# EAGLE design qad-center-v0.7 (EAGLE 6.4.4)

## Sheet 1 of 3
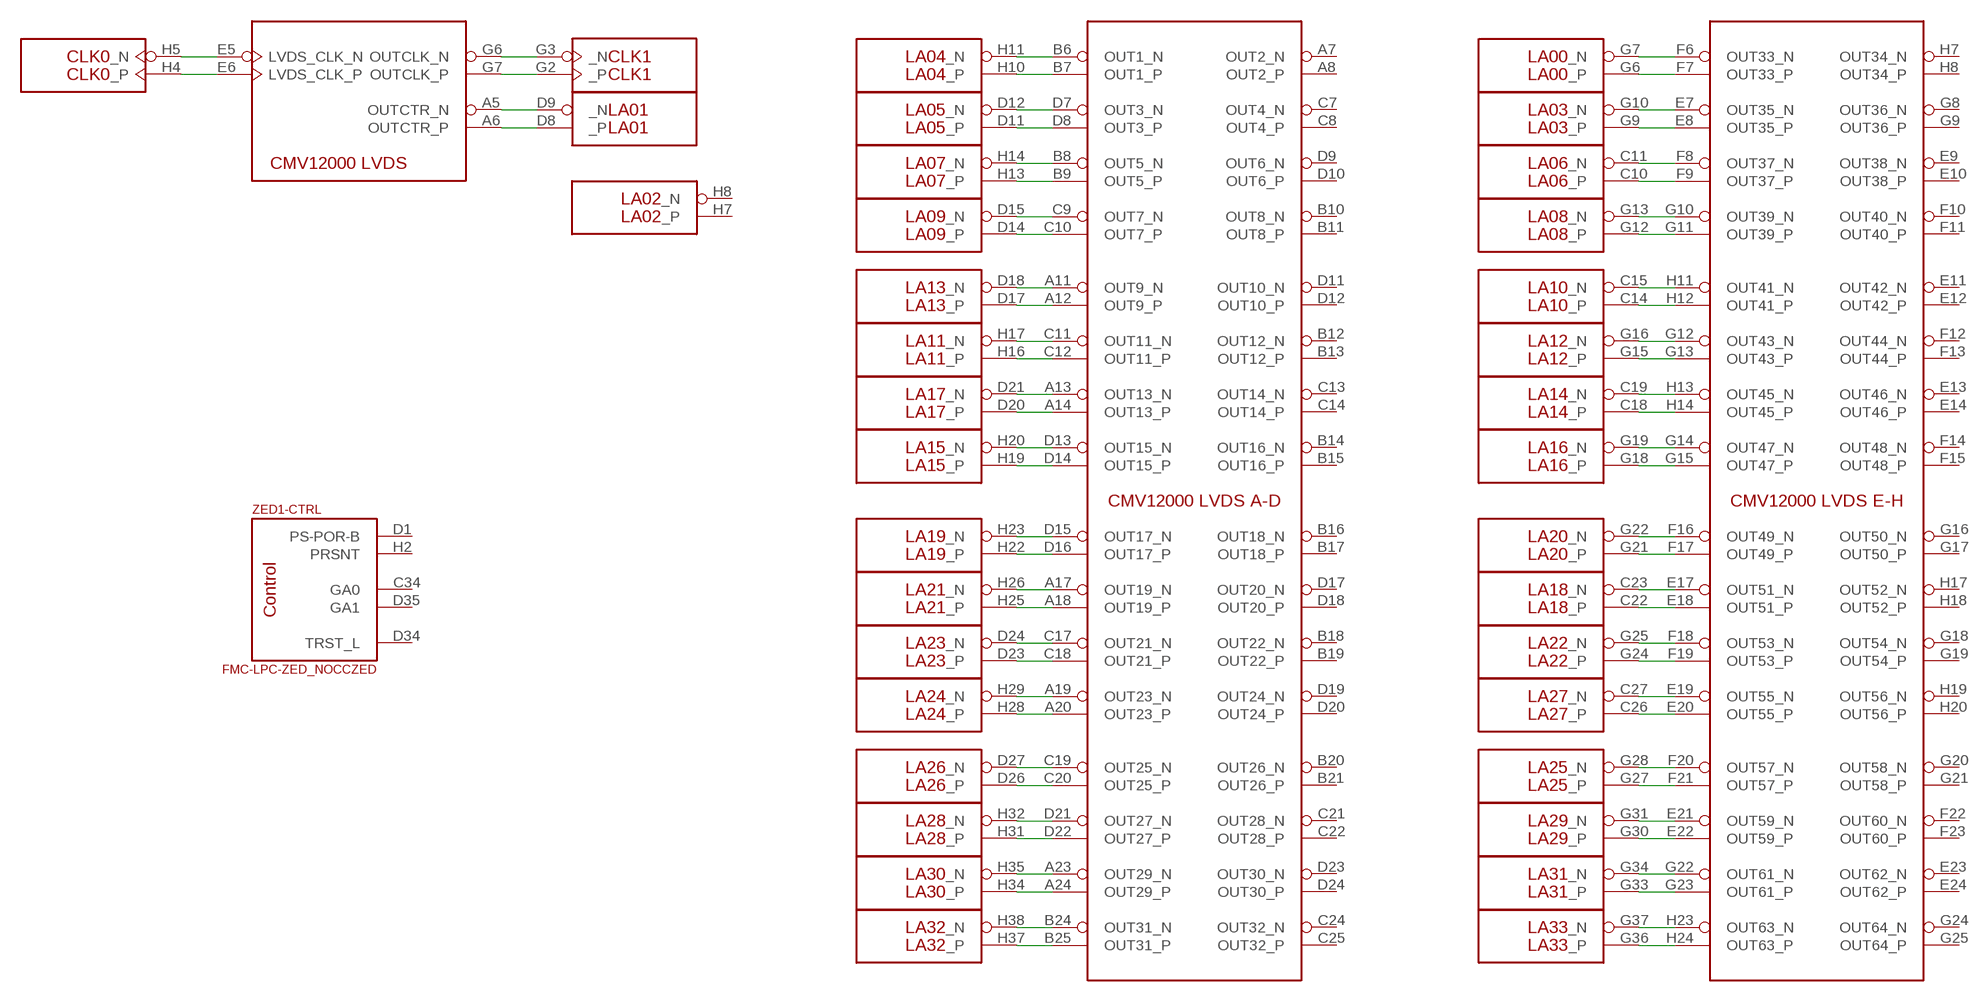
[diagram p0: schematic, sheet 1]

### Parts
U$1  CMV12000ANDON+LM  [10-30-07-237-400T4+LM]
ZED1  FMC-LPC-ZED_NOCCZED  [ASP-134604-01-ZED]

### Nets
N$24: U$1.B6(OUT1_N) ZED1.H11(LA04:_N)
N$25: U$1.B7(OUT1_P) ZED1.H10(LA04:_P)
N$27: U$1.D7(OUT3_N) ZED1.D12(LA05:_N)
N$28: U$1.D8(OUT3_P) ZED1.D11(LA05:_P)
N$34: U$1.B8(OUT5_N) ZED1.H14(LA07:_N)
N$35: U$1.C9(OUT7_N) ZED1.D15(LA09:_N)
N$36: U$1.C10(OUT7_P) ZED1.D14(LA09:_P)
N$43: U$1.G10(OUT39_N) ZED1.G13(LA08:_N)
N$44: U$1.A11(OUT9_N) ZED1.D18(LA13:_N)
N$45: U$1.A12(OUT9_P) ZED1.D17(LA13:_P)
N$46: U$1.C11(OUT11_N) ZED1.H17(LA11:_N)
N$47: U$1.C12(OUT11_P) ZED1.H16(LA11:_P)
N$48: U$1.A13(OUT13_N) ZED1.D21(LA17:_N)
N$49: U$1.A14(OUT13_P) ZED1.D20(LA17:_P)
N$50: U$1.D13(OUT15_N) ZED1.H20(LA15:_N)
N$51: U$1.D14(OUT15_P) ZED1.H19(LA15:_P)
N$52: U$1.F16(OUT49_N) ZED1.G22(LA20:_N)
N$53: U$1.F17(OUT49_P) ZED1.G21(LA20:_P)
N$54: U$1.A17(OUT19_N) ZED1.H26(LA21:_N)
N$55: U$1.A18(OUT19_P) ZED1.H25(LA21:_P)
N$56: U$1.C17(OUT21_N) ZED1.D24(LA23:_N)
N$57: U$1.C18(OUT21_P) ZED1.D23(LA23:_P)
N$58: U$1.A19(OUT23_N) ZED1.H29(LA24:_N)
N$59: U$1.A20(OUT23_P) ZED1.H28(LA24:_P)
N$60: U$1.C19(OUT25_N) ZED1.D27(LA26:_N)
N$61: U$1.C20(OUT25_P) ZED1.D26(LA26:_P)
N$62: U$1.D21(OUT27_N) ZED1.H32(LA28:_N)
N$63: U$1.D22(OUT27_P) ZED1.H31(LA28:_P)
N$64: U$1.A23(OUT29_N) ZED1.H35(LA30:_N)
N$65: U$1.A24(OUT29_P) ZED1.H34(LA30:_P)
N$66: U$1.B24(OUT31_N) ZED1.H38(LA32:_N)
N$67: U$1.B25(OUT31_P) ZED1.H37(LA32:_P)
N$68: U$1.D15(OUT17_N) ZED1.H23(LA19:_N)
N$69: U$1.D16(OUT17_P) ZED1.H22(LA19:_P)
N$70: U$1.G22(OUT61_N) ZED1.G34(LA31:_N)
N$71: U$1.G23(OUT61_P) ZED1.G33(LA31:_P)
N$72: U$1.E22(OUT59_P) ZED1.G30(LA29:_P)
N$73: U$1.E21(OUT59_N) ZED1.G31(LA29:_N)
N$74: U$1.F21(OUT57_P) ZED1.G27(LA25:_P)
N$75: U$1.F20(OUT57_N) ZED1.G28(LA25:_N)
N$76: U$1.E20(OUT55_P) ZED1.C26(LA27:_P)
N$77: U$1.E19(OUT55_N) ZED1.C27(LA27:_N)
N$78: U$1.F19(OUT53_P) ZED1.G24(LA22:_P)
N$79: U$1.F18(OUT53_N) ZED1.G25(LA22:_N)
N$80: U$1.E18(OUT51_P) ZED1.C22(LA18:_P)
N$81: U$1.E17(OUT51_N) ZED1.C23(LA18:_N)
N$82: U$1.H23(OUT63_N) ZED1.G37(LA33:_N)
N$83: U$1.H24(OUT63_P) ZED1.G36(LA33:_P)
N$84: U$1.G15(OUT47_P) ZED1.G18(LA16:_P)
N$85: U$1.G14(OUT47_N) ZED1.G19(LA16:_N)
N$86: U$1.H14(OUT45_P) ZED1.C18(LA14:_P)
N$87: U$1.H13(OUT45_N) ZED1.C19(LA14:_N)
N$88: U$1.G13(OUT43_P) ZED1.G15(LA12:_P)
N$89: U$1.G12(OUT43_N) ZED1.G16(LA12:_N)
N$90: U$1.H12(OUT41_P) ZED1.C14(LA10:_P)
N$91: U$1.H11(OUT41_N) ZED1.C15(LA10:_N)
N$92: U$1.G11(OUT39_P) ZED1.G12(LA08:_P)
N$93: U$1.B9(OUT5_P) ZED1.H13(LA07:_P)
N$94: U$1.F9(OUT37_P) ZED1.C10(LA06:_P)
N$95: U$1.F8(OUT37_N) ZED1.C11(LA06:_N)
N$96: U$1.E8(OUT35_P) ZED1.G9(LA03:_P)
N$97: U$1.E7(OUT35_N) ZED1.G10(LA03:_N)
N$98: U$1.F7(OUT33_P) ZED1.G6(LA00:_P)
N$99: U$1.F6(OUT33_N) ZED1.G7(LA00:_N)
N$100: U$1.E5(LVDS_CLK_N) ZED1.H5(CLK0:_N)
N$101: U$1.E6(LVDS_CLK_P) ZED1.H4(CLK0:_P)
N$102: U$1.G6(OUTCLK_N) ZED1.G3(CLK1:_N)
N$103: U$1.G7(OUTCLK_P) ZED1.G2(CLK1:_P)
N$104: U$1.A5(OUTCTR_N) ZED1.D9(LA01:_N)
N$105: U$1.A6(OUTCTR_P) ZED1.D8(LA01:_P)
Unconnected: U$1.A7(OUT2_N) U$1.A8(OUT2_P) U$1.B10(OUT8_N) U$1.B11(OUT8_P) U$1.B12(OUT12_N) U$1.B13(OUT12_P) U$1.B14(OUT16_N) U$1.B15(OUT16_P) U$1.B16(OUT18_N) U$1.B17(OUT18_P) U$1.B18(OUT22_N) U$1.B19(OUT22_P) U$1.B20(OUT26_N) U$1.B21(OUT26_P) U$1.C3(NC) U$1.C7(OUT4_N) U$1.C8(OUT4_P) U$1.C13(OUT14_N) U$1.C14(OUT14_P) U$1.C21(OUT28_N) U$1.C22(OUT28_P) U$1.C24(OUT32_N) U$1.C25(OUT32_P) U$1.D9(OUT6_N) U$1.D10(OUT6_P) U$1.D11(OUT10_N) U$1.D12(OUT10_P) U$1.D17(OUT20_N) U$1.D18(OUT20_P) U$1.D19(OUT24_N) U$1.D20(OUT24_P) U$1.D23(OUT30_N) U$1.D24(OUT30_P) U$1.E9(OUT38_N) U$1.E10(OUT38_P) U$1.E11(OUT42_N) U$1.E12(OUT42_P) U$1.E13(OUT46_N) U$1.E14(OUT46_P) U$1.E23(OUT62_N) U$1.E24(OUT62_P) U$1.F10(OUT40_N) U$1.F11(OUT40_P) U$1.F12(OUT44_N) U$1.F13(OUT44_P) U$1.F14(OUT48_N) U$1.F15(OUT48_P) U$1.F22(OUT60_N) U$1.F23(OUT60_P) U$1.F24(NC) U$1.F25(NC) U$1.G8(OUT36_N) U$1.G9(OUT36_P) U$1.G16(OUT50_N) U$1.G17(OUT50_P) U$1.G18(OUT54_N) U$1.G19(OUT54_P) U$1.G20(OUT58_N) U$1.G21(OUT58_P) U$1.G24(OUT64_N) U$1.G25(OUT64_P) U$1.H2(NC) U$1.H7(OUT34_N) U$1.H8(OUT34_P) U$1.H17(OUT52_N) U$1.H18(OUT52_P) U$1.H19(OUT56_N) U$1.H20(OUT56_P) ZED1.C2(-NC:C2M_P) ZED1.C3(-NC:C2M_N) ZED1.C6(-NC:M2C_P) ZED1.C7(-NC:M2C_N) ZED1.C34(-CTRL:GA0) ZED1.D1(-CTRL:PS-POR-B) ZED1.D4(-NC:CLK0-M2C_P) ZED1.D5(-NC:CLK0-M2C-N) ZED1.D29(-JTAG:TCK) ZED1.D30(-JTAG:TDI) ZED1.D31(-JTAG:TDO) ZED1.D33(-JTAG:TMS) ZED1.D34(-CTRL:TRST_L) ZED1.D35(-CTRL:GA1) ZED1.H2(-CTRL:PRSNT) ZED1.H7(LA02:_P) ZED1.H8(LA02:_N)

## Sheet 2 of 3
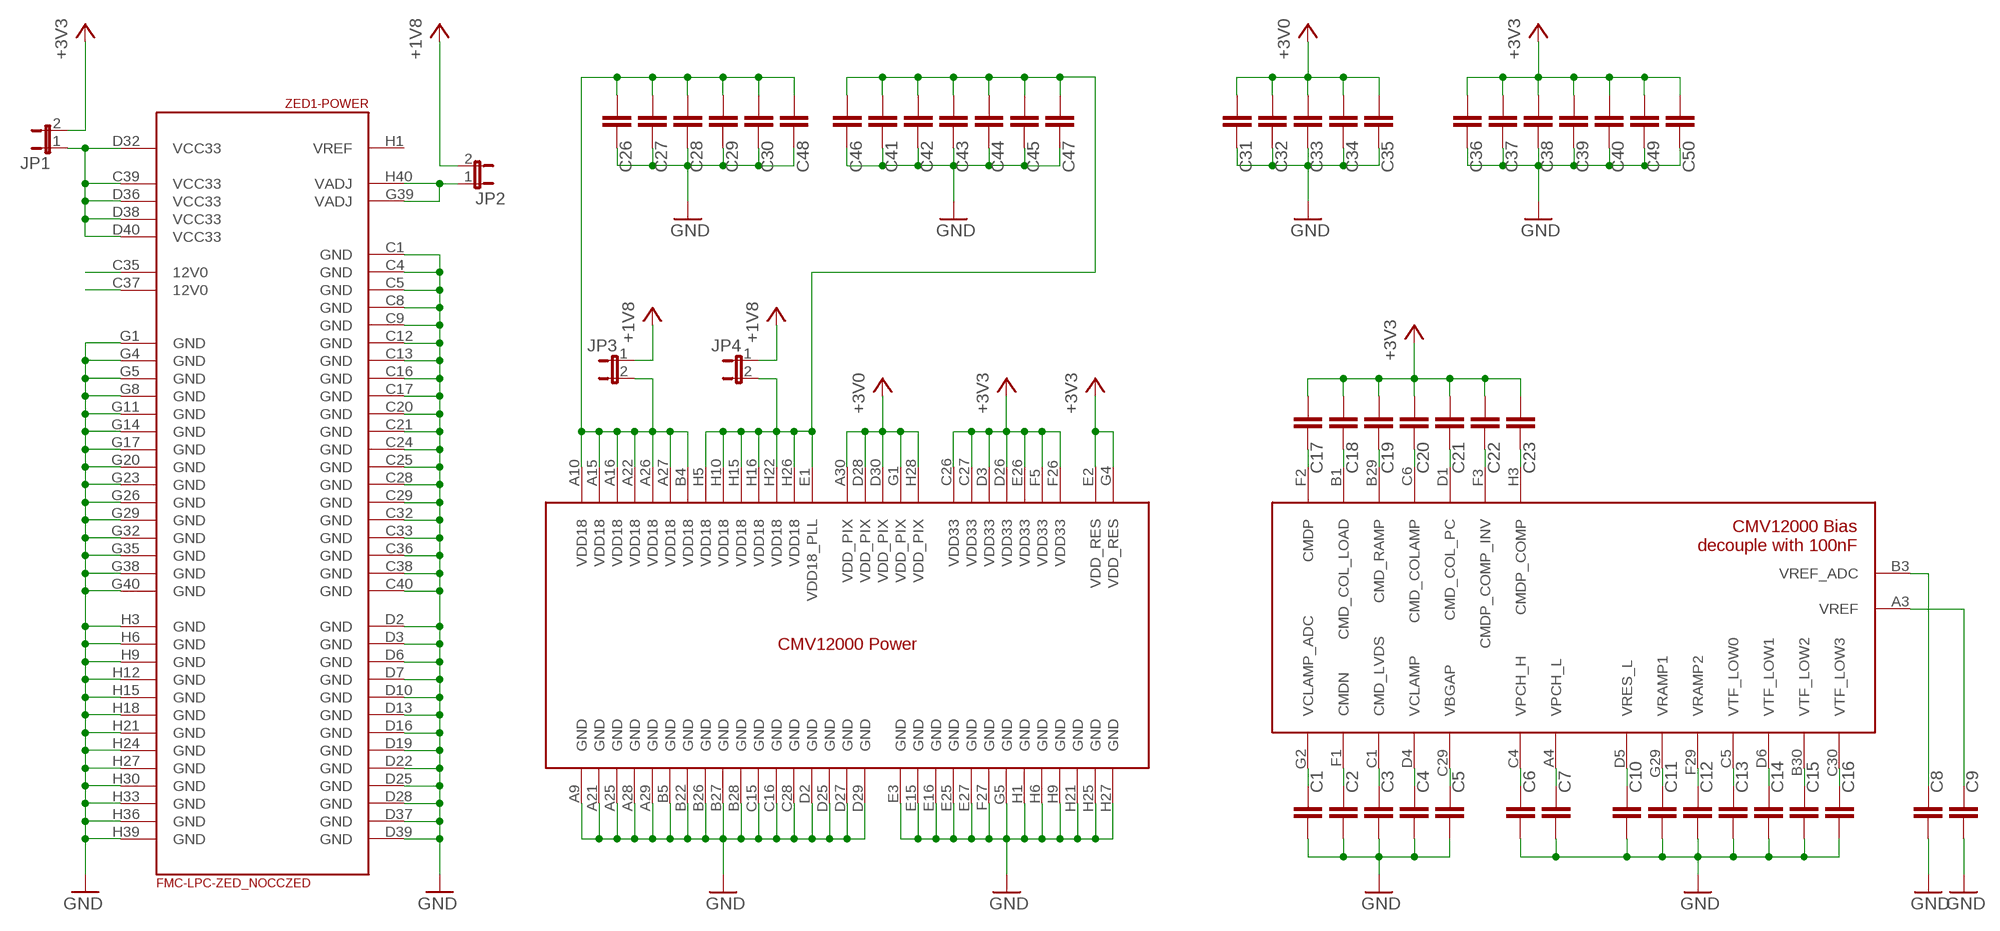
[diagram p1: schematic, sheet 2]

### Parts
C1  C-EUC0402  [C0402]
C2  C-EUC0402  [C0402]
C3  C-EUC0402  [C0402]
C4  C-EUC0402  [C0402]
C5  C-EUC0402  [C0402]
C6  C-EUC0402  [C0402]
C7  C-EUC0402  [C0402]
C8  C-EUC0402  [C0402]
C9  C-EUC0402  [C0402]
C10  C-EUC0402  [C0402]
C11  C-EUC0402  [C0402]
C12  C-EUC0402  [C0402]
C13  C-EUC0402  [C0402]
C14  C-EUC0402  [C0402]
C15  C-EUC0402  [C0402]
C16  C-EUC0402  [C0402]
C17  C-EUC0402  [C0402]
C18  C-EUC0402  [C0402]
C19  C-EUC0402  [C0402]
C20  C-EUC0402  [C0402]
C21  C-EUC0402  [C0402]
C22  C-EUC0402  [C0402]
C23  C-EUC0402  [C0402]
C26  C-EUC0402  [C0402]
C27  C-EUC0402  [C0402]
C28  C-EUC0402  [C0402]
C29  C-EUC0402  [C0402]
C30  C-EUC0402  [C0402]
C31  C-EUC0402  [C0402]
C32  C-EUC0402  [C0402]
C33  C-EUC0402  [C0402]
C34  C-EUC0402  [C0402]
C35  C-EUC0402  [C0402]
C36  C-EUC0402  [C0402]
C37  C-EUC0402  [C0402]
C38  C-EUC0402  [C0402]
C39  C-EUC0402  [C0402]
C40  C-EUC0402  [C0402]
C41  C-EUC0402  [C0402]
C42  C-EUC0402  [C0402]
C43  C-EUC0402  [C0402]
C44  C-EUC0402  [C0402]
C45  C-EUC0402  [C0402]
C46  C-EUC0402  [C0402]
C47  C-EUC0402  [C0402]
C48  C-EUC0402  [C0402]
C49  C-EUC0402  [C0402]
C50  C-EUC0402  [C0402]
JP1  JP1E  [JP1]
JP2  JP1E  [JP1]
JP3  JP1E  [JP1]
JP4  JP1E  [JP1]

### Nets
+1V8: JP2.2 JP3.1 JP4.1
+1V8A: C26.1 C27.1 C28.1 C29.1 C30.1 C48.1 JP3.2 U$1.A10(VDD18) U$1.A15(VDD18) U$1.A16(VDD18) U$1.A22(VDD18) U$1.A26(VDD18) U$1.A27(VDD18) U$1.B4(VDD18) ; also sheet 3
+1V8B: C41.1 C42.1 C43.1 C44.1 C45.1 C46.1 C47.1 JP4.2 U$1.E1(VDD18_PLL) U$1.H5(VDD18) U$1.H10(VDD18) U$1.H15(VDD18) U$1.H16(VDD18) U$1.H22(VDD18) U$1.H26(VDD18) ; also sheet 3
+3V0: C31.1 C32.1 C33.1 C34.1 C35.1 U$1.A30(VDD_PIX) U$1.D28(VDD_PIX) U$1.D30(VDD_PIX) U$1.G1(VDD_PIX) U$1.H28(VDD_PIX) ; also sheet 3
+3V3: C17.1 C18.1 C19.1 C20.1 C21.1 C22.1 C23.1 C36.1 C37.1 C38.1 C39.1 C40.1 C49.1 C50.1 JP1.2 U$1.C26(VDD33) U$1.C27(VDD33) U$1.D3(VDD33) U$1.D26(VDD33) U$1.E2(VDD_RES) U$1.E26(VDD33) U$1.F5(VDD33) U$1.F26(VDD33) U$1.G4(VDD_RES) ; also sheet 3
GND: C1.2 C2.2 C3.2 C4.2 C5.2 C6.2 C7.2 C8.2 C9.2 C10.2 C11.2 C12.2 C13.2 C14.2 C15.2 C16.2 C26.2 C27.2 C28.2 C29.2 C30.2 C31.2 C32.2 C33.2 C34.2 C35.2 C36.2 C37.2 C38.2 C39.2 C40.2 C41.2 C42.2 C43.2 C44.2 C45.2 C46.2 C47.2 C48.2 C49.2 C50.2 U$1.A9(GND) U$1.A21(GND) U$1.A25(GND) U$1.A28(GND) U$1.A29(GND) U$1.B5(GND) U$1.B22(GND) U$1.B26(GND) U$1.B27(GND) U$1.B28(GND) U$1.C15(GND) U$1.C16(GND) U$1.C28(GND) U$1.D2(GND) U$1.D25(GND) U$1.D27(GND) U$1.D29(GND) U$1.E3(GND) U$1.E15(GND) U$1.E16(GND) U$1.E25(GND) U$1.E27(GND) U$1.F27(GND) U$1.G5(GND) U$1.H1(GND) U$1.H6(GND) U$1.H9(GND) U$1.H21(GND) U$1.H25(GND) U$1.H27(GND) ZED1.C1(-POWER:GND) ZED1.C4(-POWER:GND) ZED1.C5(-POWER:GND) ZED1.C8(-POWER:GND) ZED1.C9(-POWER:GND) ZED1.C12(-POWER:GND) ZED1.C13(-POWER:GND) ZED1.C16(-POWER:GND) ZED1.C17(-POWER:GND) ZED1.C20(-POWER:GND) ZED1.C21(-POWER:GND) ZED1.C24(-POWER:GND) ZED1.C25(-POWER:GND) ZED1.C28(-POWER:GND) ZED1.C29(-POWER:GND) ZED1.C32(-POWER:GND) ZED1.C33(-POWER:GND) ZED1.C36(-POWER:GND) ZED1.C38(-POWER:GND) ZED1.C40(-POWER:GND) ZED1.D2(-POWER:GND) ZED1.D3(-POWER:GND) ZED1.D6(-POWER:GND) ZED1.D7(-POWER:GND) ZED1.D10(-POWER:GND) ZED1.D13(-POWER:GND) ZED1.D16(-POWER:GND) ZED1.D19(-POWER:GND) ZED1.D22(-POWER:GND) ZED1.D25(-POWER:GND) ZED1.D28(-POWER:GND) ZED1.D37(-POWER:GND) ZED1.D39(-POWER:GND) ZED1.G1(-POWER:GND) ZED1.G4(-POWER:GND) ZED1.G5(-POWER:GND) ZED1.G8(-POWER:GND) ZED1.G11(-POWER:GND) ZED1.G14(-POWER:GND) ZED1.G17(-POWER:GND) ZED1.G20(-POWER:GND) ZED1.G23(-POWER:GND) ZED1.G26(-POWER:GND) ZED1.G29(-POWER:GND) ZED1.G32(-POWER:GND) ZED1.G35(-POWER:GND) ZED1.G38(-POWER:GND) ZED1.G40(-POWER:GND) ZED1.H3(-POWER:GND) ZED1.H6(-POWER:GND) ZED1.H9(-POWER:GND) ZED1.H12(-POWER:GND) ZED1.H15(-POWER:GND) ZED1.H18(-POWER:GND) ZED1.H21(-POWER:GND) ZED1.H24(-POWER:GND) ZED1.H27(-POWER:GND) ZED1.H30(-POWER:GND) ZED1.H33(-POWER:GND) ZED1.H36(-POWER:GND) ZED1.H39(-POWER:GND) ; also sheet 3
N$1: C17.2 U$1.F2(CMDP)
N$2: C18.2 U$1.B1(CMD_COL_LOAD)
N$3: C19.2 U$1.B29(CMD_RAMP)
N$4: C20.2 U$1.C6(CMD_COLAMP)
N$5: C21.2 U$1.D1(CMD_COL_PC)
N$6: C22.2 U$1.F3(CMDP_COMP_INV)
N$7: C23.2 U$1.H3(CMDP_COMP)
N$8: C1.1 U$1.G2(VCLAMP_ADC)
N$9: C2.1 U$1.F1(CMDN)
N$10: C3.1 U$1.C1(CMD_LVDS)
N$11: C4.1 U$1.D4(VCLAMP)
N$12: C5.1 U$1.C29(VBGAP)
N$13: C6.1 U$1.C4(VPCH_H)
N$14: C7.1 U$1.A4(VPCH_L)
N$15: C8.1 U$1.B3(VREF_ADC)
N$16: C9.1 U$1.A3(VREF)
N$17: C10.1 U$1.D5(VRES_L)
N$18: C11.1 U$1.G29(VRAMP1)
N$19: C12.1 U$1.F29(VRAMP2)
N$20: C13.1 U$1.C5(VTF_LOW0)
N$21: C14.1 U$1.D6(VTF_LOW1)
N$22: C15.1 U$1.B30(VTF_LOW2)
N$23: C16.1 U$1.C30(VTF_LOW3)
N$37: ZED1.C35(-POWER:12V0)
N$38: JP1.1 ZED1.C39(-POWER:VCC33) ZED1.D32(-POWER:VCC33) ZED1.D36(-POWER:VCC33) ZED1.D38(-POWER:VCC33) ZED1.D40(-POWER:VCC33)
N$39: JP2.1 ZED1.G39(-POWER:VADJ) ZED1.H40(-POWER:VADJ)
N$40: ZED1.C37(-POWER:12V0)
Unconnected: ZED1.H1(-POWER:VREF)

## Sheet 3 of 3
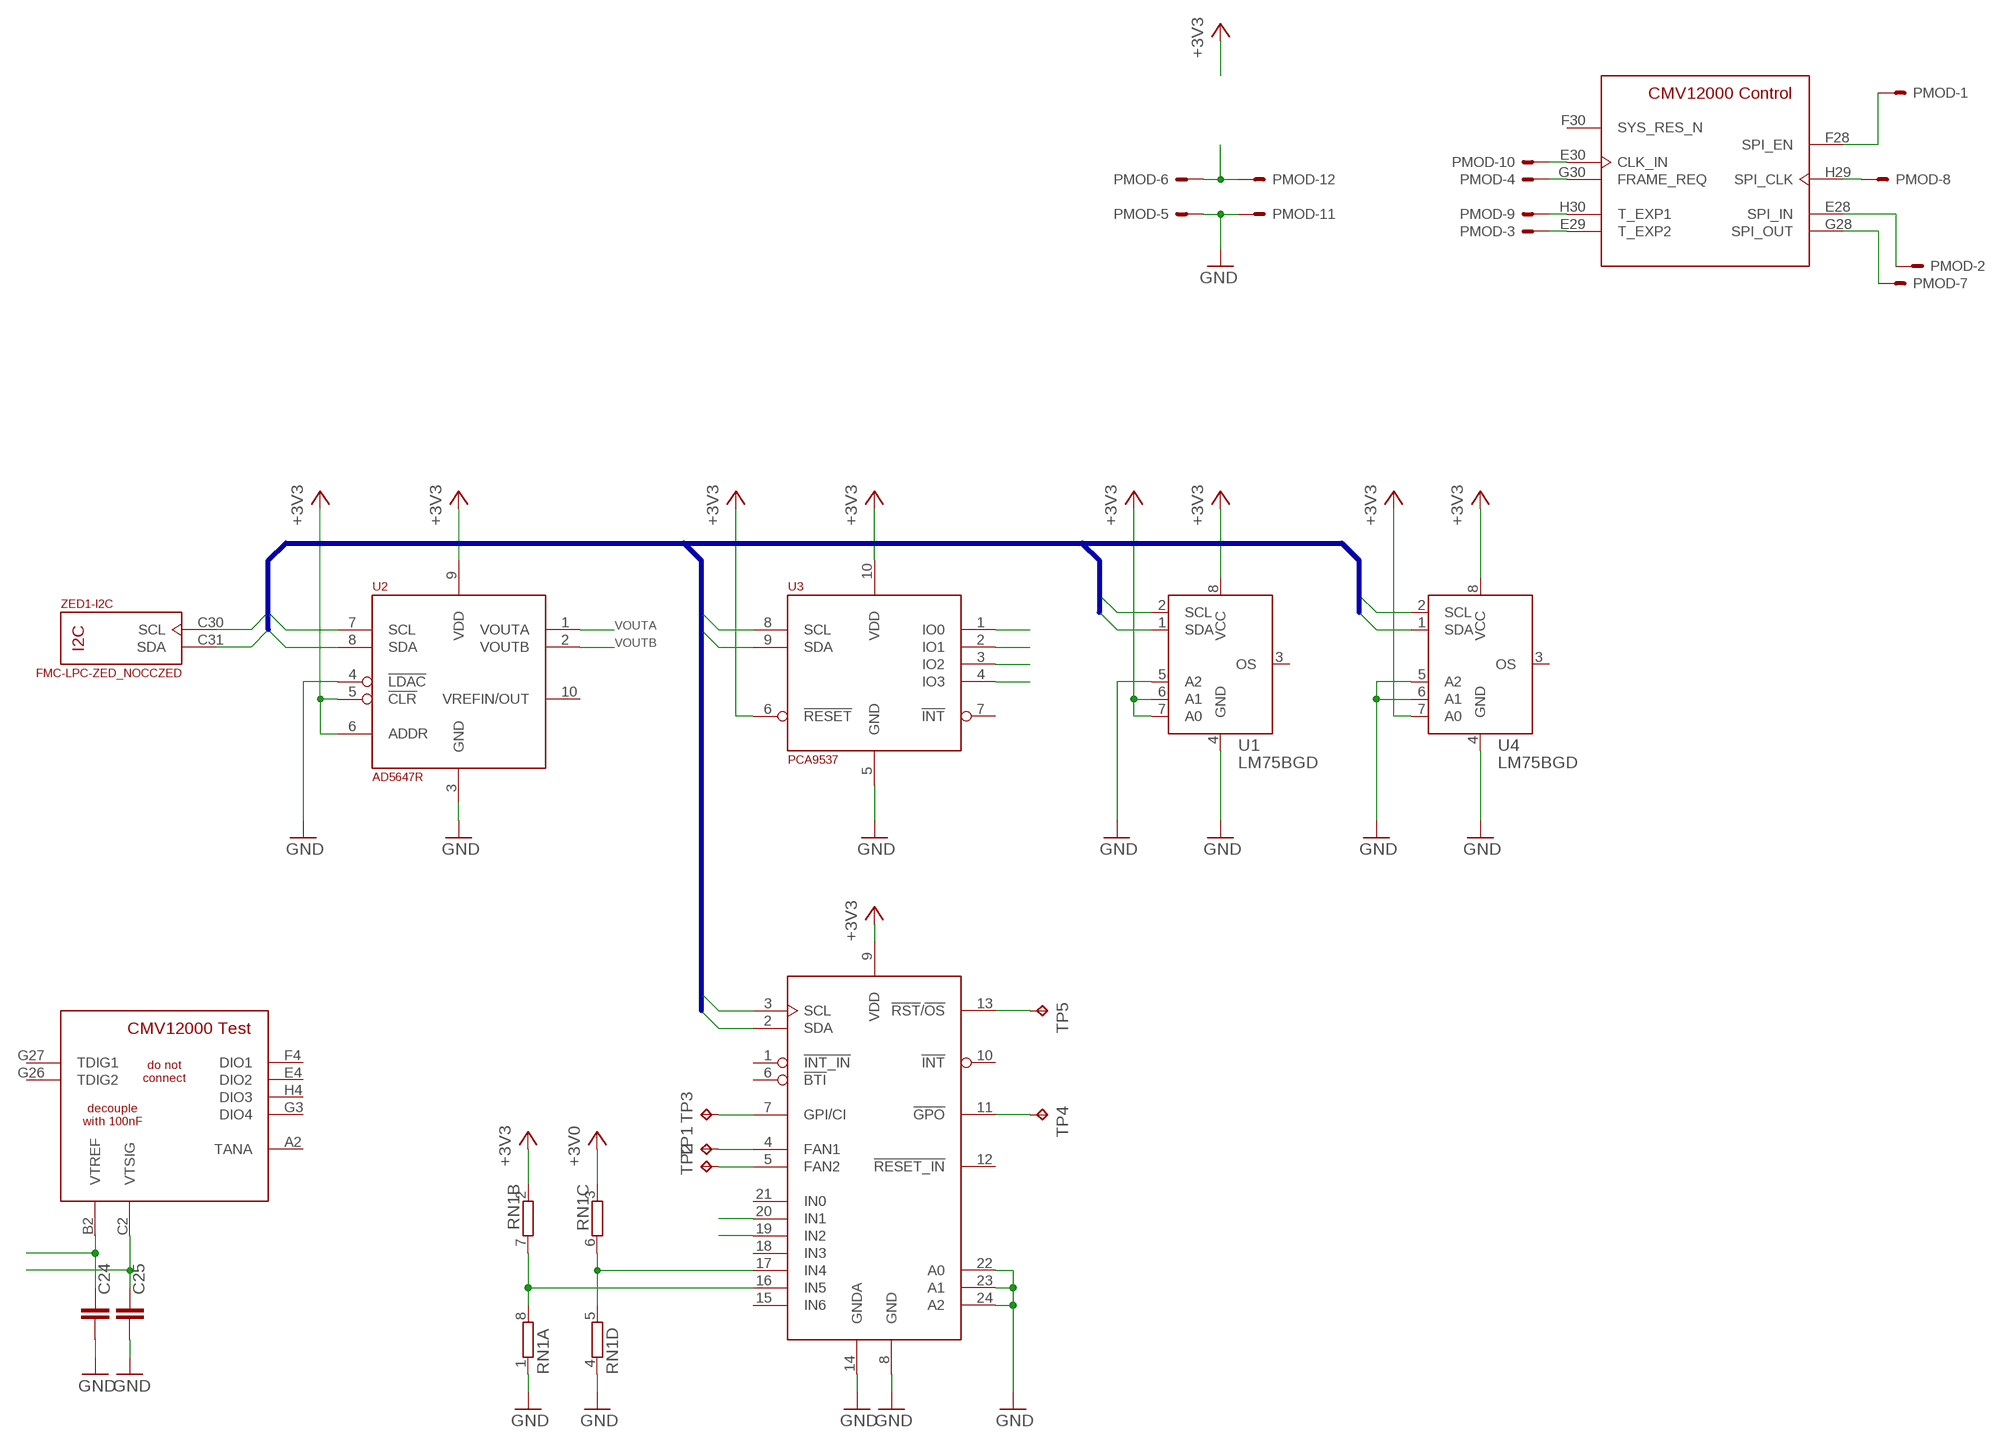
[diagram p2: schematic, sheet 3]

### Parts
C24  C-EUC0402  [C0402]
C25  C-EUC0402  [C0402]
PMOD  87758-1216-PMOD2/90  [2X06/90/2MM]
RN1  4R-NCAT16  [CAT16]
TP1  TPB1,27  [B1,27]
TP2  TPB1,27  [B1,27]
TP3  TPB1,27  [B1,27]
TP4  TPB1,27  [B1,27]
TP5  TPB1,27  [B1,27]
U1  LM75BGD  [SOT996-2/3]
U2  AD5647R  [SOP50P490X110-10N]
U3  PCA9537  [TSSOP-10]
U4  LM75BGD  [SOT996-2/3]
U$5  LM96080  [TSSOP24]

### Nets
+1V8A: U$5.19(IN2) ; also sheet 2
+1V8B: U$5.20(IN1) ; also sheet 2
+3V0: RN1.3 ; also sheet 2
+3V3: RN1.2 U1.6(A1) U1.7(A0) U1.8(VCC) U2.5(!CLR) U2.6(ADDR) U2.9(VDD) U3.6(!RESET) U3.10(VDD) U4.7(A0) U4.8(VCC) U$5.9(VDD) ; also sheet 2
GND: C24.2 C25.2 PMOD.5 PMOD.11 RN1.1 RN1.4 U1.4(GND) U1.5(A2) U2.3(GND) U2.4(!LDAC) U3.5(GND) U4.4(GND) U4.5(A2) U4.6(A1) U$5.8(GND) U$5.14(GNDA) U$5.22(A0) U$5.23(A1) U$5.24(A2) ; also sheet 2
N$26: PMOD.1 U$1.F28(SPI_EN)
N$29: PMOD.8 U$1.H29(SPI_CLK)
N$30: PMOD.2 U$1.E28(SPI_IN)
N$31: PMOD.7 U$1.G28(SPI_OUT)
N$32: PMOD.10 U$1.E30(CLK_IN)
N$33: PMOD.4 U$1.G30(FRAME_REQ)
N$106: PMOD.9 U$1.H30(T_EXP1)
N$107: PMOD.3 U$1.E29(T_EXP2)
N$108: TP1.TP U$5.4(FAN1)
N$109: PMOD.6 PMOD.12
N$110: U3.1(IO0)
N$111: U3.2(IO1)
N$112: TP2.TP U$5.5(FAN2)
N$113: U3.3(IO2)
N$114: U3.4(IO3)
N$115: RN1.5 RN1.6 U$5.17(IN4)
N$116: TP3.TP U$5.7(GPI/CI)
N$117: TP4.TP U$5.11(!GPO)
N$118: TP5.TP U$5.13(!RST!/!OS!)
N$119: RN1.7 RN1.8 U$5.16(IN5)
SCL: U1.2(SCL) U2.7(SCL) U3.8(SCL) U4.2(SCL) U$5.3(SCL) ZED1.C30(-I2C:SCL)
SDA: U1.1(SDA) U2.8(SDA) U3.9(SDA) U4.1(SDA) U$5.2(SDA) ZED1.C31(-I2C:SDA)
VOUTA: C24.1 U2.1(VOUTA) U$1.B2(VTREF)
VOUTB: C25.1 U2.2(VOUTB) U$1.C2(VTSIG)
Unconnected: U1.3(OS) U2.10(VREFIN/OUT) U3.7(!INT) U4.3(OS) U$1.A2(TANA) U$1.E4(DIO2) U$1.F4(DIO1) U$1.F30(SYS_RES_N) U$1.G3(DIO4) U$1.G26(TDIG2) U$1.G27(TDIG1) U$1.H4(DIO3) U$5.1(!INT_IN) U$5.6(!BTI) U$5.10(!INT) U$5.12(!RESET_IN) U$5.15(IN6) U$5.18(IN3) U$5.21(IN0)

### Buses
SCL,SDA

## Library data of the parts
C1-C50 = rcl:C-EU: CAPACITOR, European symbol
JP1-JP4 = jumper:JP1E: JUMPER
PMOD = pmod:87758-1216-PMOD
RN1 = resistor-dil:4R-N: Array Chip Resistor Source: RS Component / Phycomp
TP1-TP5 = testpad:TP: Test pad
U1 U4 = nxp_60:LM75B: Digital temperature sensor and thermal watchdog AAL Eindhoven MK
U2 = ad5647:AD5647R: 12-/14-/16-Bit nano Digital-to-Analog Converter; MPN: AD5647RBRMZ; OC_FARNELL: 1498712; OC_NEWARK: 15P0707; PACKAGE: MSOP-10; SUPPLIER: Analog Devices
U3 = pca9537:PCA9537: 12-/14-/16-Bit nano Digital-to-Analog Converter; MPN: AD5647RBRMZ; OC_FARNELL: 1498712; OC_NEWARK: 15P0707; PACKAGE: MSOP-10; SUPPLIER: Analog Devices
U$1 = andon-cmosis:CMV12000
U$5 = lm96080:LM96080
ZED1 = fmc-lpc:FMC-LPC-ZED_NOCC

## Board
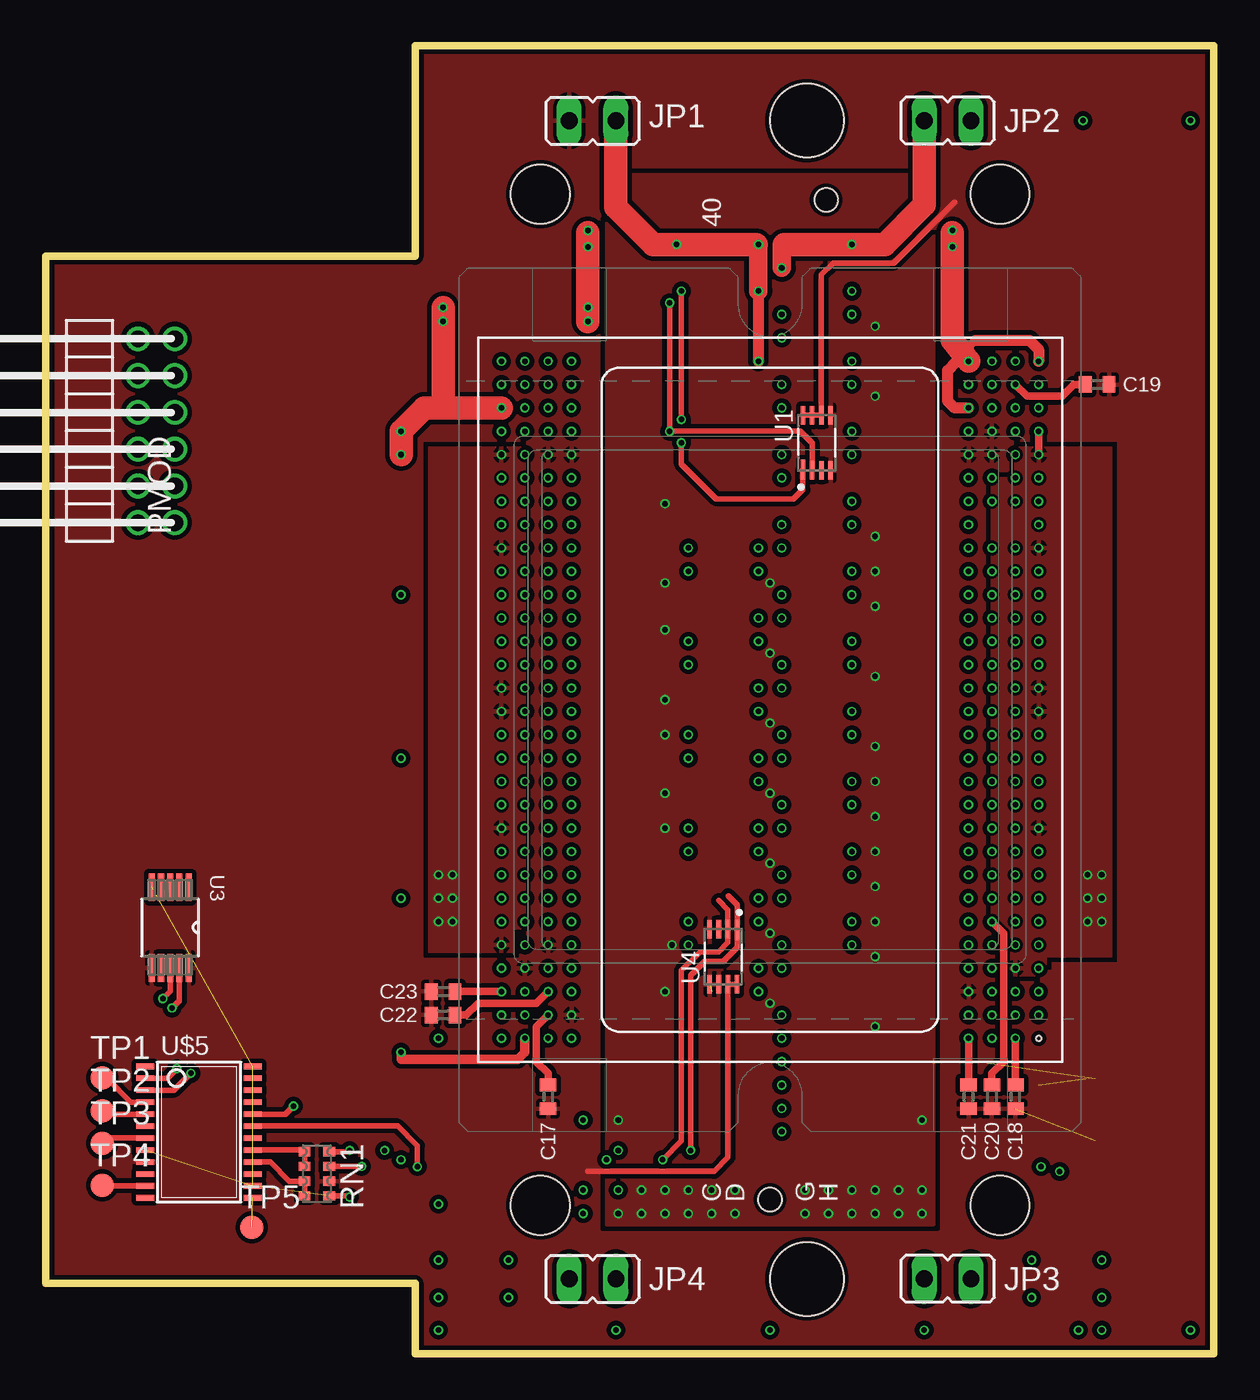
[diagram p3: board, top side]
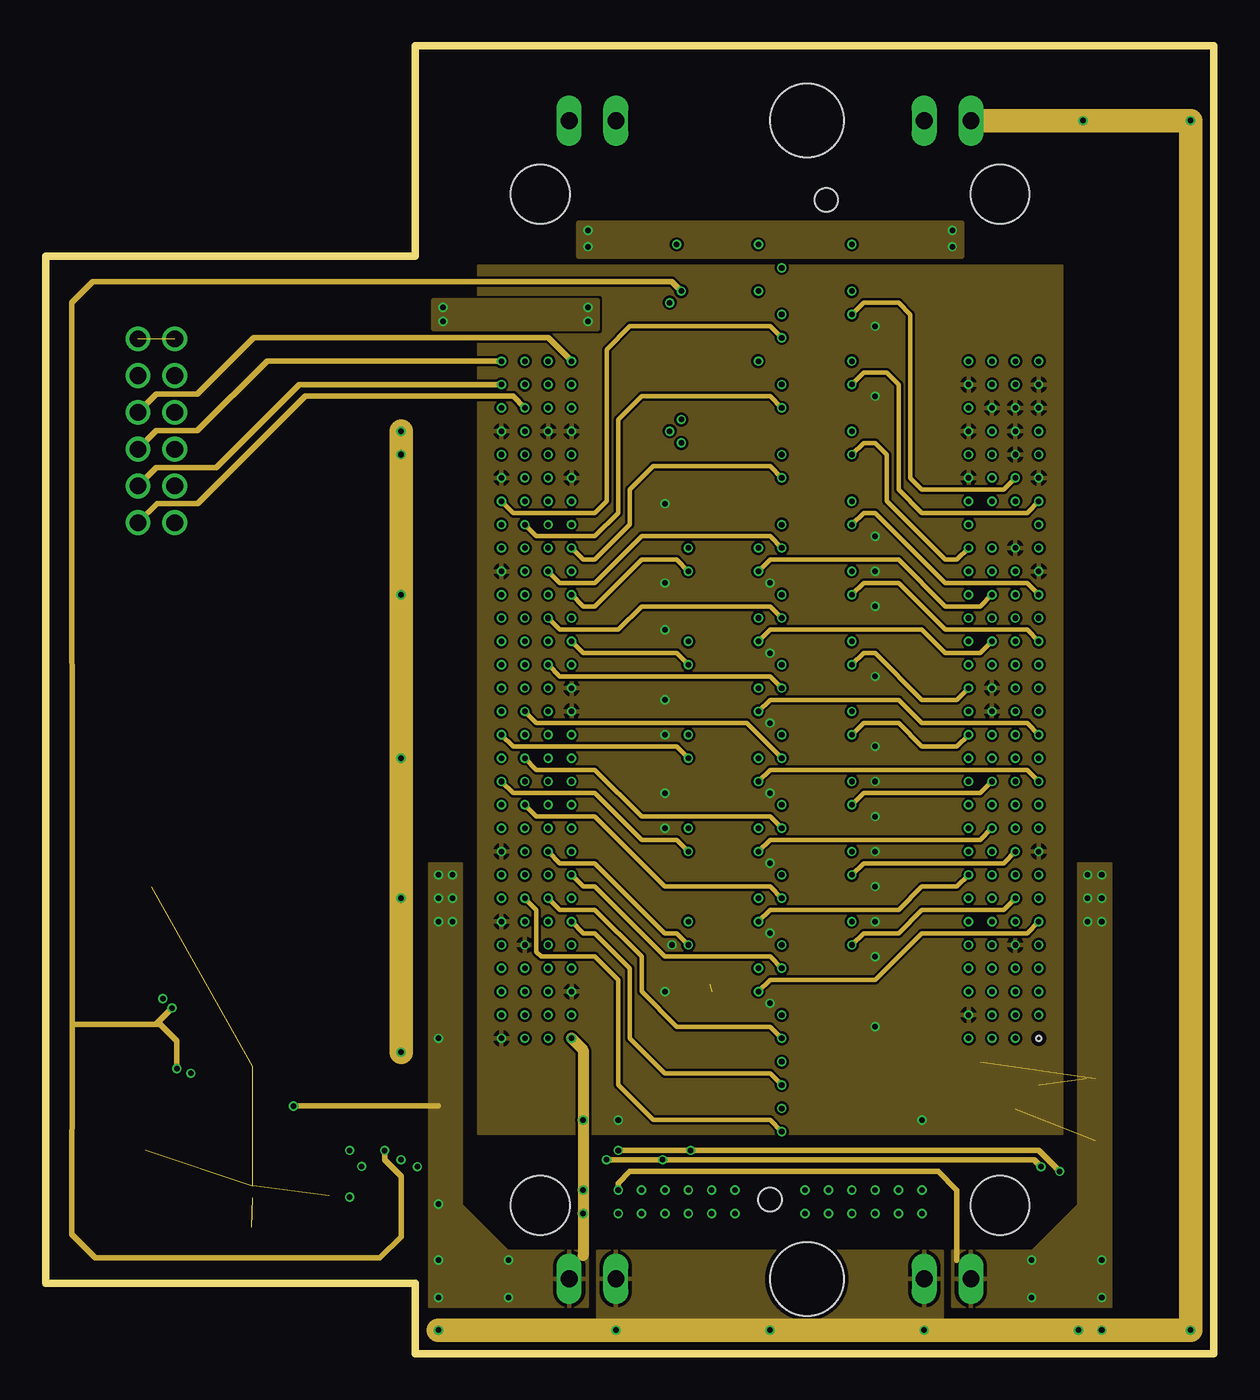
[diagram p4: board, inner layer TopSignal]
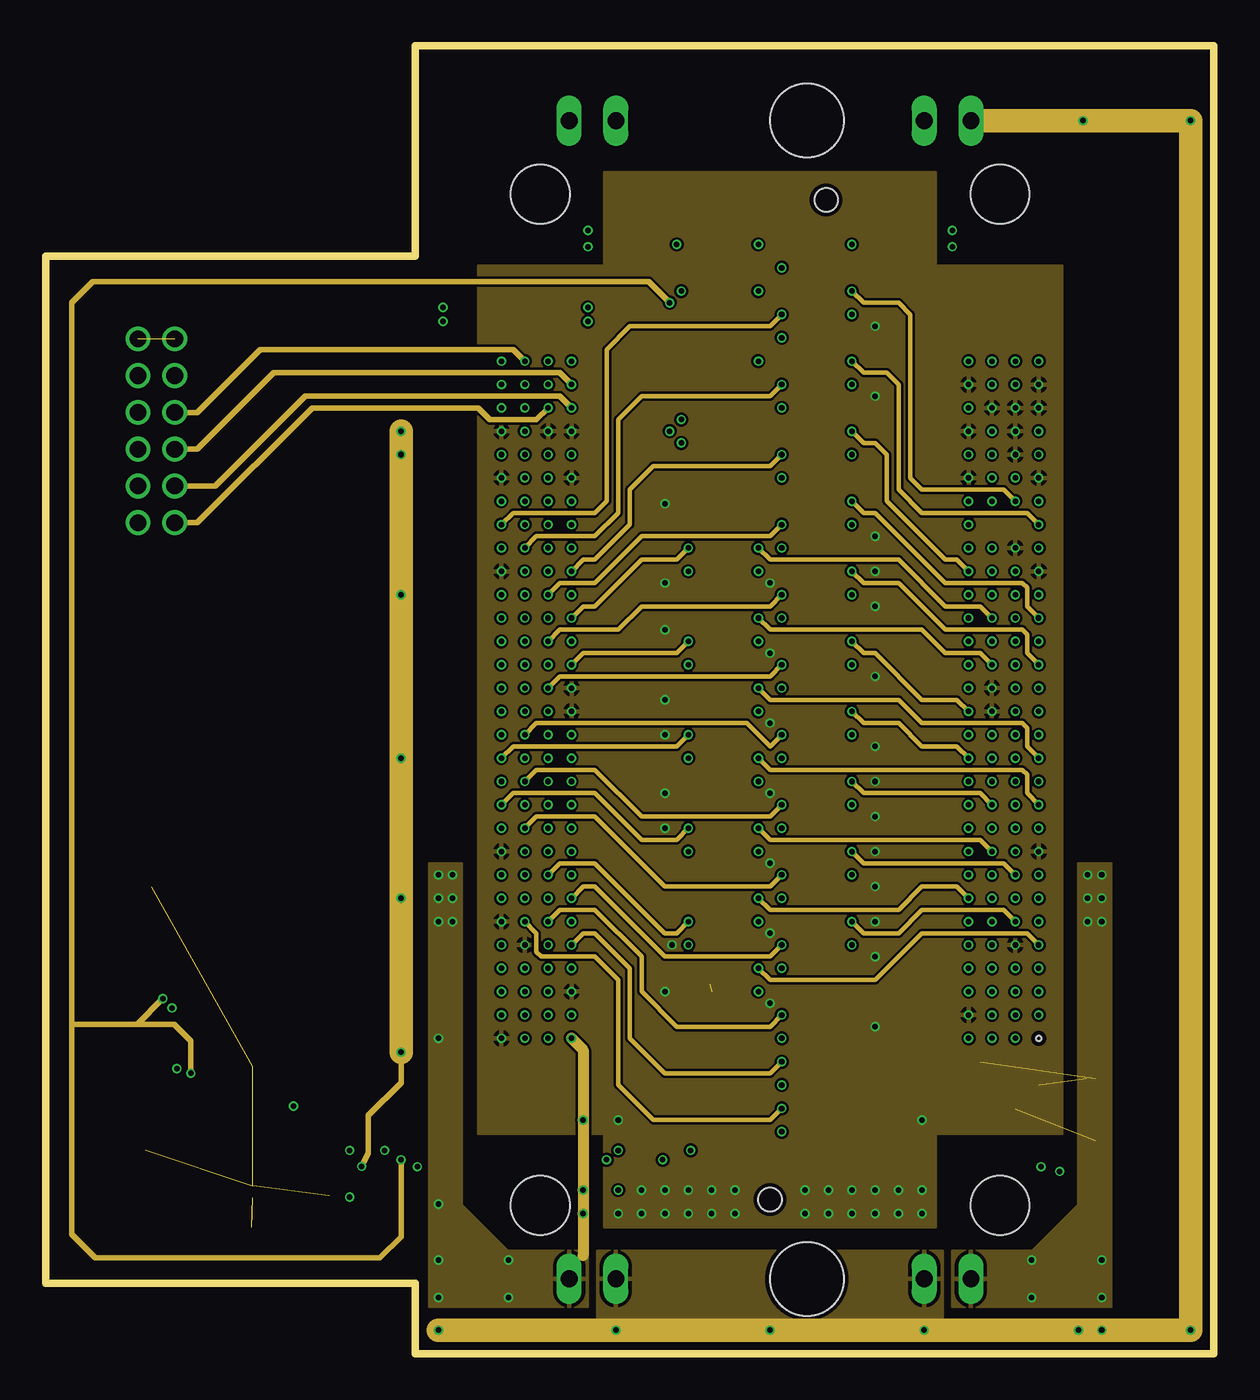
[diagram p5: board, inner layer BottomSignal]
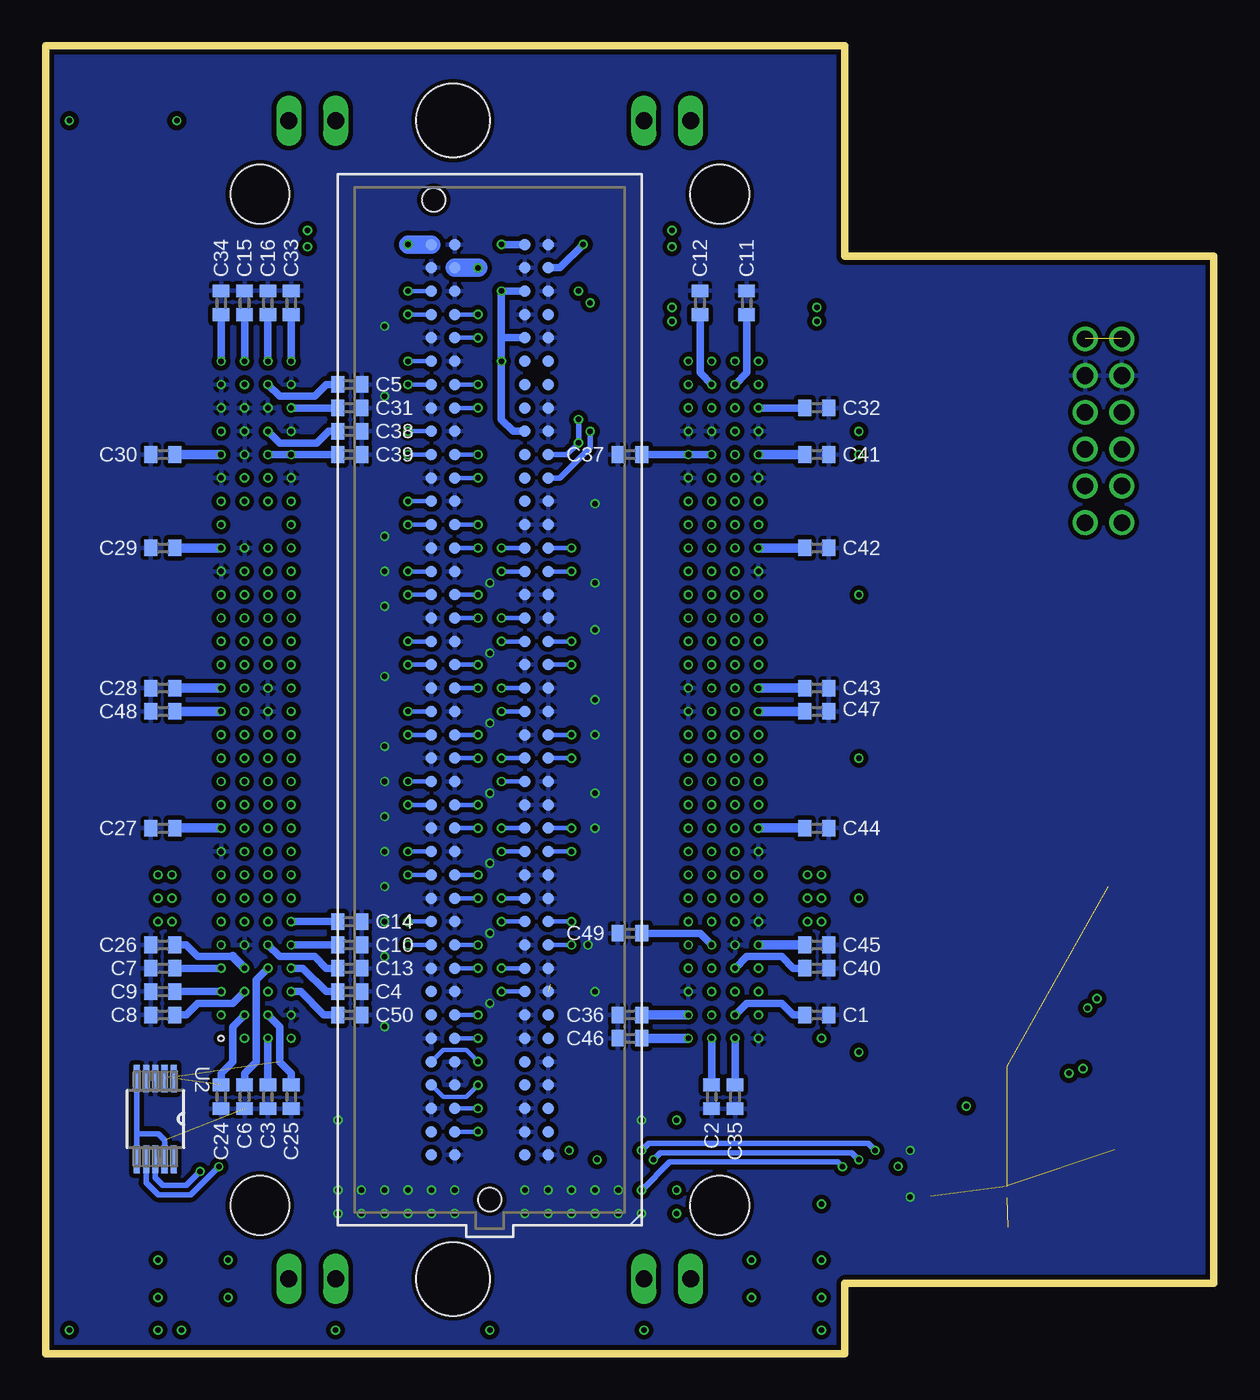
[diagram p6: board, bottom side, seen from below]

Size 63.5 x 71.12 mm. Coordinates in mm from the lower left corner, seen from the top.
Outline: 20.07,0 63.5,0 63.5,71.12 20.07,71.12 20.07,59.68 0,59.68 0,3.81 20.07,3.81 20.07,0
Copper layers (1+2*15+16): Top 0.035559375mm / dielectric 0.17018125mm / TopSignal 0.01778125mm / dielectric 47mil / BottomSignal 0.01778125mm / dielectric 0.2007mm / Bottom 0.035559375mm
Design rules "LaenPCBOrder4L *": minimum track width 5mil, minimum drill 10mil, track to track 5mil, track to pad 5mil, pad to pad 5mil, via to via 5mil, smd to smd 5mil, copper to edge 10mil, drill to drill 5mil, minimum pad ring 4mil, minimum via ring 4mil, stop-mask expansion 4mil, vias tented up to drill 20mil, thermal gap 8mil

### Footprints (pad centres in the part's own frame; a part is rotated, then mirrored left to right if it is on the bottom)
C0402 = smd 0.7 x 0.9: 1 -0.65,0; 2 0.65,0
JP1 = drill 0.914 long: 1 0,-1.27; 2 0,1.27
2X06/90/2MM = drill 0.9: 1 -5,-4; 2 -3,-4; 3 -1,-4; 4 1,-4; 5 3,-4; 6 5,-4; 7 -5,-2; 8 -3,-2; 9 -1,-2; 10 1,-2; 11 3,-2; 12 5,-2
CAT16 = smd 0.5 x 0.65: 1 -1.2,-0.675; 2 -0.4,-0.675; 3 0.4,-0.675; 4 1.2,-0.675; 5 1.2,0.675; 6 0.4,0.675; 7 -0.4,0.675; 8 -1.2,0.675
B1,27 = smd 1.27 x 1.27: TP 0,0
SOT996-2/3 = smd 0.25 x 1.1: 1 -0.75,-1.45 | smd 0.25 x 1: 2 -0.25,-1.5; 3 0.25,-1.5; 4 0.75,-1.5; 5 0.75,1.5; 6 0.25,1.5; 7 -0.25,1.5; 8 -0.75,1.5
SOP50P490X110-10N = smd 1.499 x 0.33: 1 -2.2,1; 2 -2.2,0.5; 3 -2.2,0; 4 -2.2,-0.5; 5 -2.2,-1; 6 2.2,-1; 7 2.2,-0.5; 8 2.2,0; 9 2.2,0.5; 10 2.2,1
TSSOP-10 = smd 1.499 x 0.33: 1 -2.2,1; 2 -2.2,0.5; 3 -2.2,0; 4 -2.2,-0.5; 5 -2.2,-1; 6 2.2,-1; 7 2.2,-0.5; 8 2.2,0; 9 2.2,0.5; 10 2.2,1
10-30-07-237-400T4+LM = drill 0.3: A2 -17.145,-14.605; A3 -15.875,-14.605; A4 -14.605,-14.605; A5 -13.335,-14.605; A6 -12.065,-14.605; A7 -10.795,-14.605; A8 -9.525,-14.605; A9 -8.255,-14.605; A10 -6.985,-14.605; A11 -5.715,-14.605; A12 -4.445,-14.605; A13 -3.175,-14.605; A14 -1.905,-14.605; A15 -0.635,-14.605; A16 0.635,-14.605; A17 1.905,-14.605; A18 3.175,-14.605; A19 4.445,-14.605; A20 5.715,-14.605; A21 6.985,-14.605; A22 8.255,-14.605; A23 9.525,-14.605; A24 10.795,-14.605; A25 12.065,-14.605; A26 13.335,-14.605; A27 14.605,-14.605; A28 15.875,-14.605; A29 17.145,-14.605; A30 18.415,-14.605; B1 -18.415,-13.335; B2 -17.145,-13.335; B3 -15.875,-13.335; B4 -14.605,-13.335; B5 -13.335,-13.335; B6 -12.065,-13.335; B7 -10.795,-13.335; B8 -9.525,-13.335; B9 -8.255,-13.335; B10 -6.985,-13.335; B11 -5.715,-13.335; B12 -4.445,-13.335; B13 -3.175,-13.335; B14 -1.905,-13.335; B15 -0.635,-13.335; B16 0.635,-13.335; B17 1.905,-13.335; B18 3.175,-13.335; B19 4.445,-13.335; B20 5.715,-13.335; B21 6.985,-13.335; B22 8.255,-13.335; B24 10.795,-13.335; B25 12.065,-13.335; B26 13.335,-13.335; B27 14.605,-13.335; B28 15.875,-13.335; B29 17.145,-13.335; B30 18.415,-13.335; C1 -18.415,-12.065; C2 -17.145,-12.065; C3 -15.875,-12.065; C4 -14.605,-12.065; C5 -13.335,-12.065; C6 -12.065,-12.065; C7 -10.795,-12.065; C8 -9.525,-12.065; C9 -8.255,-12.065; C10 -6.985,-12.065; C11 -5.715,-12.065; C12 -4.445,-12.065; C13 -3.175,-12.065; C14 -1.905,-12.065; C15 -0.635,-12.065; C16 0.635,-12.065; C17 1.905,-12.065; C18 3.175,-12.065; C19 4.445,-12.065; C20 5.715,-12.065; C21 6.985,-12.065; C22 8.255,-12.065; C24 10.795,-12.065; C25 12.065,-12.065; C26 13.335,-12.065; C27 14.605,-12.065; C28 15.875,-12.065; C29 17.145,-12.065; C30 18.415,-12.065; D1 -18.415,-10.795; D2 -17.145,-10.795; D3 -15.875,-10.795; D4 -14.605,-10.795; D5 -13.335,-10.795; D6 -12.065,-10.795; D7 -10.795,-10.795; D8 -9.525,-10.795; D9 -8.255,-10.795; D10 -6.985,-10.795; D11 -5.715,-10.795; D12 -4.445,-10.795; D13 -3.175,-10.795; D14 -1.905,-10.795; D15 -0.635,-10.795; D16 0.635,-10.795; D17 1.905,-10.795; D18 3.175,-10.795; D19 4.445,-10.795; D20 5.715,-10.795; D21 6.985,-10.795; D22 8.255,-10.795; D23 9.525,-10.795; D24 10.795,-10.795; D25 12.065,-10.795; D26 13.335,-10.795; D27 14.605,-10.795; D28 15.875,-10.795; D29 17.145,-10.795; D30 18.415,-10.795; E1 -18.415,10.795; E2 -17.145,10.795; E3 -15.875,10.795; E4 -14.605,10.795; E5 -13.335,10.795; E6 -12.065,10.795; E7 -10.795,10.795; E8 -9.525,10.795; E9 -8.255,10.795; E10 -6.985,10.795; E11 -5.715,10.795; E12 -4.445,10.795; E13 -3.175,10.795; E14 -1.905,10.795; E15 -0.635,10.795; E16 0.635,10.795; E17 1.905,10.795; E18 3.175,10.795; E19 4.445,10.795; E20 5.715,10.795; E21 6.985,10.795; E22 8.255,10.795; E23 9.525,10.795; E24 10.795,10.795; E25 12.065,10.795; E26 13.335,10.795; E27 14.605,10.795; E28 15.875,10.795; E29 17.145,10.795; E30 18.415,10.795; F1 -18.415,12.065; F2 -17.145,12.065; F3 -15.875,12.065; F4 -14.605,12.065; F5 -13.335,12.065; F6 -12.065,12.065; F7 -10.795,12.065; F8 -9.525,12.065; F9 -8.255,12.065; F10 -6.985,12.065; F11 -5.715,12.065; F12 -4.445,12.065; F13 -3.175,12.065; F14 -1.905,12.065; F15 -0.635,12.065; F16 0.635,12.065; F17 1.905,12.065; F18 3.175,12.065; F19 4.445,12.065; F20 5.715,12.065; F21 6.985,12.065; F22 8.255,12.065; F23 9.525,12.065; F24 10.795,12.065; F25 12.065,12.065; F26 13.335,12.065; F27 14.605,12.065; F28 15.875,12.065; F29 17.145,12.065; F30 18.415,12.065; G1 -18.415,13.335; G2 -17.145,13.335; G3 -15.875,13.335; G4 -14.605,13.335; G5 -13.335,13.335; G6 -12.065,13.335; G7 -10.795,13.335; G8 -9.525,13.335; G9 -8.255,13.335; G10 -6.985,13.335; G11 -5.715,13.335; G12 -4.445,13.335; G13 -3.175,13.335; G14 -1.905,13.335; G15 -0.635,13.335; G16 0.635,13.335; G17 1.905,13.335; G18 3.175,13.335; G19 4.445,13.335; G20 5.715,13.335; G21 6.985,13.335; G22 8.255,13.335; G23 9.525,13.335; G24 10.795,13.335; G25 12.065,13.335; G26 13.335,13.335; G27 14.605,13.335; G28 15.875,13.335; G29 17.145,13.335; G30 18.415,13.335; H1 -18.415,14.605; H2 -17.145,14.605; H3 -15.875,14.605; H4 -14.605,14.605; H5 -13.335,14.605; H6 -12.065,14.605; H7 -10.795,14.605; H8 -9.525,14.605; H9 -8.255,14.605; H10 -6.985,14.605; H11 -5.715,14.605; H12 -4.445,14.605; H13 -3.175,14.605; H14 -1.905,14.605; H15 -0.635,14.605; H16 0.635,14.605; H17 1.905,14.605; H18 3.175,14.605; H19 4.445,14.605; H20 5.715,14.605; H21 6.985,14.605; H22 8.255,14.605; H23 9.525,14.605; H24 10.795,14.605; H25 12.065,14.605; H26 13.335,14.605; H27 14.605,14.605; H28 15.875,14.605; H29 17.145,14.605; H30 18.415,14.605 | hole 0.3: -18.415,-14.605 | hole 3.2: 27.5,12.5; 27.5,-12.5; -27.5,-12.5; -27.5,12.5
TSSOP24 = smd 0.305 x 0.991: 1 -3.575,-2.918; 2 -2.925,-2.918; 3 -2.275,-2.918; 4 -1.625,-2.918; 5 -0.975,-2.918; 6 -0.325,-2.918; 7 0.325,-2.918; 8 0.975,-2.918; 9 1.625,-2.918; 10 2.275,-2.918; 11 2.925,-2.918; 12 3.575,-2.918; 13 3.575,2.918; 14 2.925,2.918; 15 2.275,2.918; 16 1.625,2.918; 17 0.975,2.918; 18 0.325,2.918; 19 -0.325,2.918; 20 -0.975,2.918; 21 -1.625,2.918; 22 -2.275,2.918; 23 -2.925,2.918; 24 -3.575,2.918
ASP-134604-01-ZED = smd 0.635 x 0.635 bottom: C1 24.765,-3.175; C2 23.495,-3.175; C3 22.225,-3.175; C4 20.955,-3.175; C5 19.685,-3.175; C6 18.415,-3.175; C7 17.145,-3.175; C8 15.875,-3.175; C9 14.605,-3.175; C10 13.335,-3.175; C11 12.065,-3.175; C12 10.795,-3.175; C13 9.525,-3.175; C14 8.255,-3.175; C15 6.985,-3.175; C16 5.715,-3.175; C17 4.445,-3.175; C18 3.175,-3.175; C19 1.905,-3.175; C20 0.635,-3.175; C21 -0.635,-3.175; C22 -1.905,-3.175; C23 -3.175,-3.175; C24 -4.445,-3.175; C25 -5.715,-3.175; C26 -6.985,-3.175; C27 -8.255,-3.175; C28 -9.525,-3.175; C29 -10.795,-3.175; C30 -12.065,-3.175; C31 -13.335,-3.175; C32 -14.605,-3.175; C33 -15.875,-3.175; C34 -17.145,-3.175; C35 -18.415,-3.175; C36 -19.685,-3.175; C37 -20.955,-3.175; C38 -22.225,-3.175; C39 -23.495,-3.175; C40 -24.765,-3.175; D1 24.765,-1.905; D2 23.495,-1.905; D3 22.225,-1.905; D4 20.955,-1.905; D5 19.685,-1.905; D6 18.415,-1.905; D7 17.145,-1.905; D8 15.875,-1.905; D9 14.605,-1.905; D10 13.335,-1.905; D11 12.065,-1.905; D12 10.795,-1.905; D13 9.525,-1.905; D14 8.255,-1.905; D15 6.985,-1.905; D16 5.715,-1.905; D17 4.445,-1.905; D18 3.175,-1.905; D19 1.905,-1.905; D20 0.635,-1.905; D21 -0.635,-1.905; D22 -1.905,-1.905; D23 -3.175,-1.905; D24 -4.445,-1.905; D25 -5.715,-1.905; D26 -6.985,-1.905; D27 -8.255,-1.905; D28 -9.525,-1.905; D29 -10.795,-1.905; D30 -12.065,-1.905; D31 -13.335,-1.905; D32 -14.605,-1.905; D33 -15.875,-1.905; D34 -17.145,-1.905; D35 -18.415,-1.905; D36 -19.685,-1.905; D37 -20.955,-1.905; D38 -22.225,-1.905; D39 -23.495,-1.905; D40 -24.765,-1.905; G1 24.765,1.905; G2 23.495,1.905; G3 22.225,1.905; G4 20.955,1.905; G5 19.685,1.905; G6 18.415,1.905; G7 17.145,1.905; G8 15.875,1.905; G9 14.605,1.905; G10 13.335,1.905; G11 12.065,1.905; G12 10.795,1.905; G13 9.525,1.905; G14 8.255,1.905; G15 6.985,1.905; G16 5.715,1.905; G17 4.445,1.905; G18 3.175,1.905; G19 1.905,1.905; G20 0.635,1.905; G21 -0.635,1.905; G22 -1.905,1.905; G23 -3.175,1.905; G24 -4.445,1.905; G25 -5.715,1.905; G26 -6.985,1.905; G27 -8.255,1.905; G28 -9.525,1.905; G29 -10.795,1.905; G30 -12.065,1.905; G31 -13.335,1.905; G32 -14.605,1.905; G33 -15.875,1.905; G34 -17.145,1.905; G35 -18.415,1.905; G36 -19.685,1.905; G37 -20.955,1.905; G38 -22.225,1.905; G39 -23.495,1.905; G40 -24.765,1.905; H1 24.765,3.175; H2 23.495,3.175; H3 22.225,3.175; H4 20.955,3.175; H5 19.685,3.175; H6 18.415,3.175; H7 17.145,3.175; H8 15.875,3.175; H9 14.605,3.175; H10 13.335,3.175; H11 12.065,3.175; H12 10.795,3.175; H13 9.525,3.175; H14 8.255,3.175; H15 6.985,3.175; H16 5.715,3.175; H17 4.445,3.175; H18 3.175,3.175; H19 1.905,3.175; H20 0.635,3.175; H21 -0.635,3.175; H22 -1.905,3.175; H23 -3.175,3.175; H24 -4.445,3.175; H25 -5.715,3.175; H26 -6.985,3.175; H27 -8.255,3.175; H28 -9.525,3.175; H29 -10.795,3.175; H30 -12.065,3.175; H31 -13.335,3.175; H32 -14.605,3.175; H33 -15.875,3.175; H34 -17.145,3.175; H35 -18.415,3.175; H36 -19.685,3.175; H37 -20.955,3.175; H38 -22.225,3.175; H39 -23.495,3.175; H40 -24.765,3.175 | hole 1.27: 27.191,0; -27.191,3.048 | hole 4: -31.5,2; 31.5,2

### Placement (x,y rotation side)
C1  21.59,18.42 0 bottom
C2  27.3,13.97 270 bottom
C3  51.44,13.97 270 bottom
C4  46.99,19.69 0 bottom
C5  46.99,52.7 0 bottom
C6  52.7,13.97 270 bottom
C7  57.15,20.96 180 bottom
C8  57.15,18.42 180 bottom
C9  57.15,19.69 180 bottom
C10  46.99,22.23 0 bottom
C11  25.4,57.15 90 bottom
C12  27.94,57.15 90 bottom
C13  46.99,20.96 0 bottom
C14  46.99,23.5 0 bottom
C15  52.7,57.15 90 bottom
C16  51.44,57.15 90 bottom
C17  27.3,13.97 90 top
C18  52.7,13.97 90 top
C19  57.15,52.7 180 top
C20  51.44,13.97 90 top
C21  50.16,13.97 90 top
C22  21.59,18.42 0 top
C23  21.59,19.69 0 top
C24  53.98,13.97 270 bottom
C25  50.16,13.97 270 bottom
C26  57.15,22.23 180 bottom
C27  57.15,28.57 180 bottom
C28  57.15,36.2 180 bottom
C29  57.15,43.81 180 bottom
C30  57.15,48.89 180 bottom
C31  46.99,51.43 0 bottom
C32  21.59,51.43 0 bottom
C33  50.16,57.15 90 bottom
C34  53.98,57.15 90 bottom
C35  26.04,13.97 270 bottom
C36  31.75,18.42 180 bottom
C37  31.75,48.89 180 bottom
C38  46.99,50.16 0 bottom
C39  46.99,48.89 0 bottom
C40  21.59,20.96 0 bottom
C41  21.59,48.89 0 bottom
C42  21.59,43.81 0 bottom
C43  21.59,36.2 0 bottom
C44  21.59,28.57 0 bottom
C45  21.59,22.23 0 bottom
C46  31.75,17.14 180 bottom
C47  21.59,34.92 0 bottom
C48  57.15,34.92 180 bottom
C49  31.75,22.86 180 bottom
C50  46.99,18.42 0 bottom
JP1  29.72,67.06 90 top
JP2  49.02,67.06 270 top
JP3  49.02,4.06 270 top
JP4  29.72,4.06 90 top
PMOD  3,50.19 90 top
RN1  14.73,9.78 90 top
TP1  3.05,14.99 0 top
TP2  3.05,13.21 0 top
TP3  3.05,11.43 0 top
TP4  3.05,9.14 0 top
TP5  11.18,6.86 0 top
U1  41.91,49.53 0 top
U2  57.55,12.76 270 bottom
U3  6.75,23.18 270 top
U4  36.83,21.59 180 top
U$1  39.37,35.56 90 top
U$5  8.32,12.05 270 top
ZED1  39.37,35.56 270 top

### Tracks (layer width: path | path; a pad name or v marks a point on that pad's centre or on a via)
+1V8  (via drill 0.3)
  TopSignal 1.27: v21.34,1.27 v30.99,1.27 v39.37,1.27 v47.75,1.27 v56.13,1.27 v57.4,1.27 v62.23,1.27 v62.23,67.06 v56.39,67.06 JP2.2
  BottomSignal 1.27: JP2.2 v56.39,67.06 v62.23,67.06 v62.23,1.27 v57.4,1.27 v56.13,1.27 v47.75,1.27 v39.37,1.27 v30.99,1.27 v21.34,1.27
  pour BottomSignal: 29.97,5.59 48.77,5.59 48.77,1.02 29.97,1.02
  pour TopSignal: 29.97,5.59 48.77,5.59 48.77,1.02 29.97,1.02
+1V8A  (via drill 0.3)
  Top 0.305: v20.19,10.16 20.19,11.3 19.12,12.37 U$5.19
  Top 0.406: U$1.A26 U$1.A27
  TopSignal 0.305: 49.53,5.08 49.53,8.89 48.51,9.91 31.75,9.91 31.11,9.27 v31.11,8.89
  Bottom 0.305: v31.11,8.89 29.59,10.41 20.45,10.41 v20.19,10.16
  Bottom 0.406: C26.1 55.88,22.23 55.24,21.59 53.34,21.59
  Bottom 0.508: C27.1 U$1.A10 | 53.34,21.59 U$1.B4 | C28.1 U$1.A16 | C29.1 U$1.A22 | C30.1 U$1.A26 | U$1.A15 C48.1
  other vias: 56.64,26.04 57.4,26.04 56.64,24.77 57.4,24.77 56.64,23.5 57.4,23.5 53.59,5.08 53.59,3.05 57.4,5.08 57.4,3.05
  pour BottomSignal: 49.28,5.59 53.59,5.59 56.13,8.13 56.13,26.67 57.91,26.67 57.91,2.54 49.28,2.54
  pour Top (isolate 0.152, rank 3): 57.91,49.28 52.7,49.28 52.7,47.62 51.44,47.62 51.44,21.59 52.32,21.59 52.32,20.57 54.36,20.57 54.36,21.59 57.91,21.59
  pour TopSignal: 49.28,5.59 53.59,5.59 56.13,8.13 56.13,26.67 57.91,26.67 57.91,2.54 49.28,2.54
+1V8B  (via drill 0.3)
  Top 0.305: U$5.20 13.02,13.02 v13.46,13.46
  TopSignal 0.305: v13.46,13.46 21.34,13.46
  TopSignal 0.61: U$1.E1 29.21,16.51 v29.21,12.7 v29.21,8.89 v29.21,7.62 29.21,5.33
  BottomSignal 0.61: 29.21,5.33 v29.21,7.62 v29.21,8.89 v29.21,12.7 29.21,16.51 U$1.E1
  Bottom 0.508: C42.1 U$1.H22 | C43.1 U$1.H16 | C41.1 U$1.H26 | C44.1 U$1.H10 | C45.1 U$1.H5 | U$1.H15 C47.1 | C46.1 U$1.E1
  other vias: 21.34,26.04 22.1,26.04 21.34,24.77 22.1,24.77 21.34,23.5 22.1,23.5 21.34,3.05 25.15,3.05 25.15,5.08 21.34,5.08 21.34,8.13 21.34,17.14
  pour TopSignal: 20.83,26.67 22.61,26.67 22.61,8.13 25.15,5.59 29.46,5.59 29.46,2.54 20.83,2.54
  pour Top (isolate 0.152, rank 3): 26.04,23.11 26.04,49.28 20.83,49.28 20.83,21.84 25.4,21.84 25.4,23.11
  pour BottomSignal: 20.83,26.67 22.61,26.67 22.61,8.13 25.15,5.59 29.46,5.59 29.46,2.54 20.83,2.54
+3V0  (via drill 0.3)
  Top 0.305: v17.16,10.18 RN1.3
  Top 0.406: 50.16,54.74 50.55,55.12
  Top 0.508: U$1.G1 26.04,16.38 25.65,16 19.3,16 v19.3,16.38
  Top 0.61: U$1.D28 49.4,51.43 49.02,51.82 49.02,53.47 49.53,53.97 U$1.D30 50.16,54.74 | 50.55,55.12 53.47,55.12 53.98,54.61 U$1.A30
  Top 1.27: U$1.D30 49.28,55.12 v49.28,60.2 49.28,60.96 | v19.3,48.89 v19.3,50.16 20.57,51.43 21.59,51.43 | v29.46,56.13 v29.46,56.9 v29.46,60.2 29.46,60.96 | U$1.H28 21.59,51.43 | v21.59,56.9 v21.59,56.13 21.59,51.43
  TopSignal 0.508: 19.3,16.26 v19.3,16.38
  TopSignal 1.27: v19.3,50.16 v19.3,48.89 v19.3,41.27 v19.3,32.38 v19.3,24.77 v19.3,16.38
  BottomSignal 0.305: v17.16,10.18 17.53,10.92 17.53,12.95 19.3,14.73 v19.3,16.38
  BottomSignal 1.27: v19.3,16.38 v19.3,24.77 v19.3,32.38 v19.3,41.27 v19.3,48.89 v19.3,50.16
  Bottom 0.406: C32.1 U$1.H28 | C31.1 U$1.D28 | C33.1 U$1.D30 | C34.1 U$1.A30 | U$1.G1 C35.1
  other vias: 29.46,61.09 49.28,61.09
  pour TopSignal: 28.96,61.47 49.78,61.47 49.78,59.69 28.96,59.69
  pour TopSignal: 21.08,57.28 21.08,55.75 29.97,55.75 29.97,57.28
+3V3  (1 unrouted)
  Top 0.305: 49.42,62.61 49.42,62.63 46.1,59.31 42.8,59.31 42.16,58.67 U1.6 U1.7 U1.8 | U4.8 U4.7 37.08,10.66 36.32,9.91 29.46,9.91
  Bottom 0.305: U2.6 58.55,11.94 | 58.55,11.94 U2.5 | U2.9 57.05,11.59 57.4,11.94 58.55,11.94
  Bottom 0.406: U$1.G4 25.4,21.59 23.5,21.59 22.86,20.96 C40.1 | C38.1 48.13,50.16 48.77,49.53 50.8,49.53 U$1.C27 | C39.1 U$1.C26 | C37.1 U$1.F26 | C50.1 48.39,18.42 49.66,19.69 U$1.D3 | C49.1 27.94,22.86 U$1.F5
  Bottom 0.508: C36.1 U$1.E2
  pour Top (isolate 0.254, rank 4): 20.07,71.12 63.5,71.12 63.5,0 20.07,0 20.07,3.81 0,3.81 0,59.69 20.07,59.69
GND  (via drill 0.3)  (7 unrouted)
  Top 0.305: RN1.1 16.44,8.58 v16.51,8.51 | RN1.4 16.44,10.98 v16.51,11.05
  other vias: 31.11,12.7 47.62,7.62 46.35,7.62 45.09,7.62 47.62,8.89 39.37,41.91 39.37,38.1 39.37,34.29 39.37,30.48 39.37,26.67 39.37,22.86 39.37,19.05 45.09,25.4 45.09,21.59 45.09,17.78 45.09,29.21 45.09,33.02 45.09,36.83 45.09,40.64 45.09,44.45 45.09,52.07 45.09,55.88 33.66,30.48 33.66,35.56 33.66,19.69 46.35,8.89 33.66,39.37 33.66,41.91 47.62,12.7 45.09,8.89 43.81,8.89 42.55,8.89 43.81,7.62 42.55,7.62 41.27,8.89 41.27,7.62 32.38,8.89 33.66,8.89 34.92,8.89 34.92,7.62 36.2,7.62 36.2,8.89 37.47,7.62 37.47,8.89 31.11,7.62 32.38,7.62 33.66,7.62 33.66,46.23 45.09,42.54 45.09,31.11 45.09,27.3 45.09,23.5 33.66,33.66 33.66,28.57 34.04,22.23
  pour Bottom (isolate 0.254): 20.07,71.12 63.5,71.12 63.5,0 20.07,0 20.07,3.81 0,3.81 0,59.69 20.07,59.69
  pour Top (isolate 0.254, rank 3): 30.48,64.13 48.26,64.13 48.26,6.98 30.48,6.98
  pour TopSignal (rank 2): 23.5,11.94 55.24,11.94 55.24,59.18 23.5,59.18
  pour BottomSignal: 48.39,6.86 48.39,11.94 55.24,11.94 55.24,59.18 48.39,59.18 48.39,64.26 30.35,64.26 30.35,59.18 23.5,59.18 23.5,11.94 30.35,11.94 30.35,6.86
N$1
  Top 0.406: U$1.F2 26.67,17.78 26.67,15.87 27.3,15.24 C17.2
N$2
  Top 0.406: C18.2 U$1.B1
N$3
  Top 0.406: U$1.B29 53.34,52.07 55.24,52.07 55.88,52.7 C19.2
N$4
  Top 0.406: C20.2 51.44,15.24 52.07,15.87 52.07,22.86 U$1.C6
N$5
  Top 0.406: U$1.D1 C21.2
N$6
  Top 0.406: C22.2 22.86,18.42 23.5,19.05 26.67,19.05 U$1.F3
N$7
  Top 0.406: C23.2 U$1.H3
N$8
  Bottom 0.406: U$1.G2 25.4,19.05 23.5,19.05 22.86,18.42 C1.1
N$9
  Bottom 0.406: C2.1 U$1.F1
N$10
  Bottom 0.406: C3.1 U$1.C1
N$11
  Bottom 0.406: C4.1 48.26,19.69 49.53,20.96 U$1.D4
N$12
  Bottom 0.406: C5.1 48.26,52.7 48.9,52.07 50.8,52.07 U$1.C29
N$13
  Bottom 0.406: U$1.C4 52.07,20.32 52.07,15.87 52.7,15.24 C6.1
N$14
  Bottom 0.406: C7.1 U$1.A4
N$15
  Bottom 0.406: U$1.B3 53.34,19.05 55.24,19.05 55.88,18.42 C8.1
N$16
  Bottom 0.406: C9.1 U$1.A3
N$17
  Bottom 0.406: C10.1 U$1.D5
N$18
  Bottom 0.406: C11.1 25.4,53.34 U$1.G29
N$19
  Bottom 0.406: C12.1 27.94,53.34 U$1.F29
N$20
  Bottom 0.406: U$1.C5 50.8,21.59 48.9,21.59 48.26,20.96 C13.1
N$21
  Bottom 0.406: C14.1 U$1.D6
N$22
  Bottom 0.406: C15.1 U$1.B30
N$23
  Bottom 0.406: C16.1 U$1.C30
N$24  (via drill 0.3)
  BottomSignal 0.254: U$1.B6 52.07,24.13 47.62,24.13 46.35,22.86 44.45,22.86 v43.81,23.5
  Bottom 0.254: v43.81,23.5 ZED1.H11
N$25  (via drill 0.3)
  TopSignal 0.254: U$1.B7 52.07,24.13 47.62,24.13 46.35,22.86 44.45,22.86 v43.81,22.23
  Bottom 0.254: v43.81,22.23 ZED1.H10
N$26
  BottomSignal 0.305: U$1.F28 26.67,50.8 24.13,50.8 23.5,51.43 14.48,51.43 8.23,45.19 PMOD.1
N$27  (via drill 0.3)
  BottomSignal 0.254: U$1.D7 49.53,25.4 47.62,25.4 46.35,24.13 39.37,24.13 v38.73,24.77
  Bottom 0.254: v38.73,24.77 ZED1.D12
N$28  (via drill 0.3)
  TopSignal 0.254: U$1.D8 49.53,25.4 47.62,25.4 46.35,24.13 39.37,24.13 v38.73,23.5
  Bottom 0.254: v38.73,23.5 ZED1.D11
N$29
  TopSignal 0.305: U$1.H29 13.77,52.7 9.25,48.19 6,48.19 PMOD.8
N$30
  BottomSignal 0.305: U$1.E28 27.94,52.07 14.1,52.07 9.22,47.19 PMOD.2
N$31
  TopSignal 0.305: U$1.G28 25.4,52.07 14.1,52.07 8.26,46.23 6.04,46.23 PMOD.7
N$32
  TopSignal 0.305: U$1.E30 27.3,55.24 11.29,55.24 8.24,52.19 6,52.19 PMOD.10
N$33
  BottomSignal 0.305: U$1.G30 25.4,54.61 11.66,54.61 8.24,51.19 PMOD.4
N$34  (via drill 0.3)
  BottomSignal 0.254: U$1.B8 52.07,26.67 44.45,26.67 v43.81,27.3
  Bottom 0.254: v43.81,27.3 ZED1.H14
N$35  (via drill 0.3)
  BottomSignal 0.254: U$1.C9 50.8,27.94 39.37,27.94 v38.73,28.57
  Bottom 0.254: v38.73,28.57 ZED1.D15
N$36  (via drill 0.3)
  TopSignal 0.254: U$1.C10 50.8,27.94 39.37,27.94 v38.73,27.3
  Bottom 0.254: v38.73,27.3 ZED1.D14
N$38  (via drill 0.3)
  Top 0.61: v38.73,57.78 v38.73,53.97
  Top 1.016: v38.73,57.78 v38.73,60.33 38.61,60.33
  Top 1.27: 38.61,60.33 v34.29,60.33 33.02,60.33 30.99,62.36 JP1.1
  Bottom 0.406: ZED1.D32 38.1,50.16 38.73,50.8 v38.73,53.97 | v38.73,53.97 38.73,55.24 | 38.73,55.24 v38.73,57.78 | ZED1.C39 35.56,59.05 v34.29,60.33 | ZED1.D36 38.73,55.24 | v38.73,57.78 ZED1.D38 | v38.73,60.33 ZED1.D40 | v38.73,53.97 v38.73,57.78
N$39  (via drill 0.3)
  Top 1.016: v40.01,59.05 40.01,60.33 40.13,60.33
  Top 1.27: 40.13,60.33 v43.81,60.33 45.59,60.33 47.75,62.48 JP2.1
  Bottom 1.016: ZED1.G39 v40.01,59.05 | v43.81,60.33 ZED1.H40
N$43  (via drill 0.3)
  BottomSignal 0.254: U$1.G10 26.67,29.21 29.84,29.21 33.66,25.4 39.37,25.4 v40.01,26.04
  Bottom 0.254: v40.01,26.04 ZED1.G13
N$44  (via drill 0.3)
  BottomSignal 0.254: v38.73,32.38 39.37,31.75 53.09,31.75 53.34,31.5 53.34,30.48 U$1.A11
  Bottom 0.254: v38.73,32.38 ZED1.D18
N$45  (via drill 0.3)
  TopSignal 0.254: U$1.A12 53.34,31.75 39.37,31.75 v38.73,31.11
  Bottom 0.254: v38.73,31.11 ZED1.D17
N$46  (via drill 0.3)
  BottomSignal 0.254: U$1.C11 50.8,30.48 44.45,30.48 v43.81,31.11
  Bottom 0.254: v43.81,31.11 ZED1.H17
N$47  (via drill 0.3)
  TopSignal 0.254: U$1.C12 50.8,30.48 44.45,30.48 v43.81,29.85
  Bottom 0.254: v43.81,29.85 ZED1.H16
N$48  (via drill 0.3)
  BottomSignal 0.254: v38.73,36.2 39.37,35.56 46.35,35.56 47.62,34.29 53.09,34.29 53.34,34.04 53.34,33.02 U$1.A13
  Bottom 0.254: v38.73,36.2 ZED1.D21
N$49  (via drill 0.3)
  TopSignal 0.254: U$1.A14 53.34,34.29 47.62,34.29 46.35,35.56 39.37,35.56 v38.73,34.92
  Bottom 0.254: v38.73,34.92 ZED1.D20
N$50  (via drill 0.3)
  BottomSignal 0.254: U$1.D13 49.53,33.02 47.62,33.02 46.35,34.29 44.45,34.29 v43.81,34.92
  Bottom 0.254: v43.81,34.92 ZED1.H20
N$51  (via drill 0.3)
  TopSignal 0.254: U$1.D14 49.53,33.02 47.62,33.02 46.35,34.29 44.45,34.29 v43.81,33.66
  Bottom 0.254: v43.81,33.66 ZED1.H19
N$52  (via drill 0.3)
  BottomSignal 0.254: U$1.F16 27.94,36.83 39.37,36.83 v40.01,37.46
  Bottom 0.254: v40.01,37.46 ZED1.G22
N$53  (via drill 0.3)
  TopSignal 0.254: U$1.F17 27.94,36.83 39.37,36.83 v40.01,36.2
  Bottom 0.254: v40.01,36.2 ZED1.G21
N$54  (via drill 0.3)
  BottomSignal 0.254: v43.81,42.54 44.45,41.91 46.35,41.91 48.9,39.37 53.09,39.37 53.34,39.12 53.34,38.1 U$1.A17
  Bottom 0.254: v43.81,42.54 ZED1.H26
N$55  (via drill 0.3)
  TopSignal 0.254: U$1.A18 53.34,39.37 48.9,39.37 46.35,41.91 44.45,41.91 v43.81,41.27
  Bottom 0.254: v43.81,41.27 ZED1.H25
N$56  (via drill 0.3)
  BottomSignal 0.254: U$1.C17 50.8,38.1 48.9,38.1 47.62,39.37 39.37,39.37 v38.73,40
  Bottom 0.254: v38.73,40 ZED1.D24
N$57  (via drill 0.3)
  TopSignal 0.254: U$1.C18 50.8,38.1 48.9,38.1 47.62,39.37 39.37,39.37 v38.73,38.73
  Bottom 0.254: v38.73,38.73 ZED1.D23
N$58  (via drill 0.3)
  BottomSignal 0.254: v43.81,46.35 44.45,45.72 45.09,45.72 48.9,41.91 53.09,41.91 53.34,41.66 53.34,40.64 U$1.A19
  Bottom 0.254: v43.81,46.35 ZED1.H29
N$59  (via drill 0.3)
  TopSignal 0.254: U$1.A20 53.34,41.91 48.9,41.91 45.09,45.72 44.45,45.72 v43.81,45.09
  Bottom 0.254: v43.81,45.09 ZED1.H28
N$60  (via drill 0.3)
  BottomSignal 0.254: U$1.C19 50.8,40.64 48.9,40.64 46.35,43.18 39.37,43.18 v38.73,43.81
  Bottom 0.254: v38.73,43.81 ZED1.D27
N$61  (via drill 0.3)
  TopSignal 0.254: U$1.C20 50.8,40.64 48.9,40.64 46.35,43.18 39.37,43.18 v38.73,42.54
  Bottom 0.254: v38.73,42.54 ZED1.D26
N$62  (via drill 0.3)
  BottomSignal 0.254: U$1.D21 49.53,43.18 48.9,43.18 45.72,46.35 45.72,48.89 45.09,49.53 44.45,49.53 v43.81,50.16
  Bottom 0.254: v43.81,50.16 ZED1.H32
N$63  (via drill 0.3)
  TopSignal 0.254: U$1.D22 49.53,43.18 48.9,43.18 45.72,46.35 45.72,48.89 45.09,49.53 44.45,49.53 v43.81,48.89
  Bottom 0.254: v43.81,48.89 ZED1.H31
N$64  (via drill 0.3)
  BottomSignal 0.254: U$1.A23 53.34,45.72 47.62,45.72 46.35,46.99 46.35,52.7 45.72,53.34 44.45,53.34 v43.81,53.97
  Bottom 0.254: v43.81,53.97 ZED1.H35
N$65  (via drill 0.3)
  TopSignal 0.254: U$1.A24 53.34,45.72 47.62,45.72 46.35,46.99 46.35,52.7 45.72,53.34 44.45,53.34 v43.81,52.7
  Bottom 0.254: v43.81,52.7 ZED1.H34
N$66  (via drill 0.3)
  BottomSignal 0.254: U$1.B24 52.07,46.99 47.62,46.99 46.99,47.62 46.99,56.52 46.35,57.15 44.45,57.15 v43.81,57.78
  Bottom 0.254: v43.81,57.78 ZED1.H38
N$67  (via drill 0.3)
  TopSignal 0.254: U$1.B25 52.07,46.99 47.62,46.99 46.99,47.62 46.99,56.52 46.35,57.15 44.45,57.15 v43.81,56.52
  Bottom 0.254: v43.81,56.52 ZED1.H37
N$68  (via drill 0.3)
  BottomSignal 0.254: U$1.D15 49.53,35.56 47.62,35.56 45.09,38.1 44.45,38.1 v43.81,38.73
  Bottom 0.254: v43.81,38.73 ZED1.H23
N$69  (via drill 0.3)
  TopSignal 0.254: U$1.D16 49.53,35.56 47.62,35.56 45.09,38.1 44.45,38.1 v43.81,37.46
  Bottom 0.254: v43.81,37.46 ZED1.H22
N$70  (via drill 0.3)
  BottomSignal 0.254: U$1.G22 26.67,44.45 29.84,44.45 31.11,45.72 31.11,50.8 32.38,52.07 39.37,52.07 v40.01,52.7
  Bottom 0.254: v40.01,52.7 ZED1.G34
N$71  (via drill 0.3)
  TopSignal 0.254: U$1.G23 26.67,44.45 29.84,44.45 31.11,45.72 31.11,50.8 32.38,52.07 39.37,52.07 v40.01,51.43
  Bottom 0.254: v40.01,51.43 ZED1.G33
N$72  (via drill 0.3)
  TopSignal 0.254: U$1.E22 29.21,43.18 29.84,43.18 31.75,45.09 31.75,46.99 33.02,48.26 39.37,48.26 v40.01,47.62
  Bottom 0.254: v40.01,47.62 ZED1.G30
N$73  (via drill 0.3)
  BottomSignal 0.254: U$1.E21 29.21,43.18 29.84,43.18 31.75,45.09 31.75,46.99 33.02,48.26 39.37,48.26 v40.01,48.89
  Bottom 0.254: v40.01,48.89 ZED1.G31
N$74  (via drill 0.3)
  TopSignal 0.254: U$1.F21 27.94,41.91 29.84,41.91 32.38,44.45 39.37,44.45 v40.01,43.81
  Bottom 0.254: v40.01,43.81 ZED1.G27
N$75  (via drill 0.3)
  BottomSignal 0.254: U$1.F20 27.94,41.91 29.84,41.91 32.38,44.45 39.37,44.45 v40.01,45.09
  Bottom 0.254: v40.01,45.09 ZED1.G28
N$76  (via drill 0.3)
  TopSignal 0.254: U$1.E20 29.21,40.64 29.84,40.64 32.38,43.18 34.29,43.18 v34.92,42.54
  Bottom 0.254: v34.92,42.54 ZED1.C26
N$77  (via drill 0.3)
  BottomSignal 0.254: U$1.E19 29.21,40.64 29.84,40.64 32.38,43.18 34.29,43.18 v34.92,43.81
  Bottom 0.254: v34.92,43.81 ZED1.C27
N$78  (via drill 0.3)
  TopSignal 0.254: U$1.F19 27.94,39.37 31.11,39.37 32.38,40.64 39.37,40.64 v40.01,40
  Bottom 0.254: v40.01,40 ZED1.G24
N$79  (via drill 0.3)
  BottomSignal 0.254: U$1.F18 27.94,39.37 31.11,39.37 32.38,40.64 39.37,40.64 v40.01,41.27
  Bottom 0.254: v40.01,41.27 ZED1.G25
N$80  (via drill 0.3)
  TopSignal 0.254: U$1.E18 29.21,38.1 34.29,38.1 v34.92,37.46
  Bottom 0.254: v34.92,37.46 ZED1.C22
N$81  (via drill 0.3)
  BottomSignal 0.254: U$1.E17 29.21,38.1 34.29,38.1 v34.92,38.73
  Bottom 0.254: v34.92,38.73 ZED1.C23
N$82  (via drill 0.3)
  BottomSignal 0.254: U$1.H23 25.4,45.72 29.84,45.72 30.48,46.35 30.48,54.61 31.75,55.88 39.37,55.88 v40.01,56.52
  Bottom 0.254: v40.01,56.52 ZED1.G37
N$83  (via drill 0.3)
  TopSignal 0.254: U$1.H24 25.4,45.72 29.84,45.72 30.48,46.35 30.48,54.61 31.75,55.88 39.37,55.88 v40.01,55.24
  Bottom 0.254: v40.01,55.24 ZED1.G36
N$84  (via drill 0.3)
  TopSignal 0.254: U$1.G15 26.67,34.29 38.1,34.29 v40.01,32.38
  Bottom 0.254: v40.01,32.38 ZED1.G18
N$85  (via drill 0.3)
  BottomSignal 0.254: U$1.G14 26.67,34.29 38.1,34.29 39.37,33.02 v40.01,33.66
  Bottom 0.254: v40.01,33.66 ZED1.G19
N$86  (via drill 0.3)
  TopSignal 0.254: U$1.H14 25.4,33.02 34.29,33.02 v34.92,32.38
  Bottom 0.254: v34.92,32.38 ZED1.C18
N$87  (via drill 0.3)
  BottomSignal 0.254: U$1.H13 25.4,33.02 34.29,33.02 v34.92,33.66
  Bottom 0.254: v34.92,33.66 ZED1.C19
N$88  (via drill 0.3)
  TopSignal 0.254: U$1.G13 26.67,31.75 29.84,31.75 32.38,29.21 39.37,29.21 v40.01,28.57
  Bottom 0.254: v40.01,28.57 ZED1.G15
N$89  (via drill 0.3)
  BottomSignal 0.254: U$1.G12 26.67,31.75 29.84,31.75 32.38,29.21 39.37,29.21 v40.01,29.85
  Bottom 0.254: ZED1.G16 v40.01,29.85
N$90  (via drill 0.3)
  TopSignal 0.254: U$1.H12 25.4,30.48 29.84,30.48 32.38,27.94 34.29,27.94 v34.92,27.3
  Bottom 0.254: v34.92,27.3 ZED1.C14
N$91  (via drill 0.3)
  BottomSignal 0.254: U$1.H11 25.4,30.48 29.84,30.48 32.38,27.94 34.29,27.94 v34.92,28.57
  Bottom 0.254: v34.92,28.57 ZED1.C15
N$92  (via drill 0.3)
  TopSignal 0.254: U$1.G11 26.67,29.21 29.84,29.21 33.66,25.4 39.37,25.4 v40.01,24.77
  Bottom 0.254: v40.01,24.77 ZED1.G12
N$93  (via drill 0.3)
  TopSignal 0.254: U$1.B9 52.07,26.67 44.45,26.67 v43.81,26.04
  Bottom 0.254: v43.81,26.04 ZED1.H13
N$94  (via drill 0.3)
  TopSignal 0.254: U$1.F9 27.94,26.67 29.84,26.67 33.66,22.86 34.29,22.86 v34.92,22.23
  Bottom 0.254: v34.92,22.23 ZED1.C10
N$95  (via drill 0.3)
  BottomSignal 0.254: U$1.F8 27.94,26.67 29.84,26.67 33.66,22.86 34.29,22.86 v34.92,23.5
  Bottom 0.254: ZED1.C11 v34.92,23.5
N$96  (via drill 0.3)
  TopSignal 0.254: U$1.E8 29.21,25.4 29.84,25.4 33.66,21.59 39.37,21.59 v40.01,20.96
  Bottom 0.254: v40.01,20.96 ZED1.G9
N$97  (via drill 0.3)
  BottomSignal 0.254: U$1.E7 29.21,25.4 29.84,25.4 33.66,21.59 39.37,21.59 v40.01,22.23
  Bottom 0.254: v40.01,22.23 ZED1.G10
N$98  (via drill 0.3)
  TopSignal 0.254: U$1.F7 27.94,24.13 29.84,24.13 32.38,21.59 32.38,19.69 34.29,17.78 39.37,17.78 v40.01,17.14
  Bottom 0.254: v40.01,17.14 ZED1.G6
N$99  (via drill 0.3)
  BottomSignal 0.254: U$1.F6 27.94,24.13 29.84,24.13 32.38,21.59 32.38,19.69 34.29,17.78 39.37,17.78 v40.01,18.42
  Bottom 0.254: ZED1.G7 v40.01,18.42
N$100  (via drill 0.3)
  BottomSignal 0.254: U$1.E5 29.21,22.86 29.84,22.86 31.75,20.96 31.75,17.14 33.66,15.24 39.37,15.24 v40.01,15.87
  Bottom 0.254: ZED1.H5 41.91,16.51 40.64,16.51 v40.01,15.87
N$101  (via drill 0.3)
  TopSignal 0.254: U$1.E6 29.21,22.86 29.84,22.86 31.75,20.96 31.75,17.14 33.66,15.24 39.37,15.24 v40.01,14.6
  Bottom 0.254: v40.01,14.6 40.64,13.97 41.91,13.97 ZED1.H4
N$102  (via drill 0.3)
  BottomSignal 0.254: U$1.G6 26.67,22.86 26.67,21.84 26.92,21.59 29.84,21.59 31.11,20.32 31.11,14.6 33.02,12.7 39.37,12.7 v40.01,13.33
  Bottom 0.254: ZED1.G3 v40.01,13.33
N$103  (via drill 0.3)
  TopSignal 0.254: U$1.G7 26.67,24.13 26.67,21.84 26.92,21.59 29.84,21.59 31.11,20.32 31.11,14.6 33.02,12.7 39.37,12.7 v40.01,12.06
  Bottom 0.254: v40.01,12.06 ZED1.G2
N$104  (via drill 0.3)
  BottomSignal 0.254: U$1.A5 53.34,22.86 47.62,22.86 45.09,20.32 39.37,20.32 v38.73,20.96
  Bottom 0.254: v38.73,20.96 ZED1.D9
N$105  (via drill 0.3)
  TopSignal 0.254: U$1.A6 53.34,22.86 47.62,22.86 45.09,20.32 39.37,20.32 v38.73,19.69
  Bottom 0.254: v38.73,19.69 ZED1.D8
N$106
  TopSignal 0.305: U$1.H30 12.02,53.97 8.24,50.19 6,50.19 PMOD.9
N$107
  BottomSignal 0.305: U$1.E29 27.94,53.34 12.39,53.34 8.24,49.19 PMOD.3
N$108
  Top 0.305: U$5.4 4.62,13.67 3.3,14.99 TP1.TP
N$109  (1 unrouted)
N$112
  Top 0.305: U$5.5 3.23,13.02 TP2.TP
N$115
  Top 0.305: U$5.17 13.96,11.07 RN1.5 RN1.6
N$116
  Top 0.305: U$5.7 3.34,11.72 TP3.TP
N$117
  Top 0.305: U$5.11 3.07,9.12 TP4.TP
N$118  (1 unrouted)
N$119
  Top 0.305: RN1.8 RN1.7 13.23,9.38 12.19,10.42 U$5.16
SCL  (via drill 0.3)
  Top 0.305: 36.58,24.64 37.08,24.13 U4.2 37.08,22.35 36.58,21.84 35.56,21.84 34.54,20.83 34.54,11.56 v33.53,10.54 | U1.2 41.66,49.53 41.02,50.16 v33.91,50.16 v33.91,57.15 | U$5.3 6.96,14.32 v7.87,15.24 | U3.8 6.75,19.71 v6.35,19.3
  TopSignal 0.305: v54.1,10.16 53.72,10.54 v33.53,10.54 v30.48,10.54
  BottomSignal 0.305: v33.91,57.15 32.77,58.29 2.54,58.29 1.4,57.15 1.4,17.91 | 1.4,17.91 1.4,6.48 2.67,5.21 18.16,5.21 19.3,6.35 v19.3,10.54 | v7.87,15.24 7.87,17.02 6.99,17.91 4.95,17.91 | 1.4,17.91 4.57,17.91 4.95,17.91 | v6.35,19.3 4.95,17.91
  Bottom 0.305: ZED1.C30 35.56,47.62 33.91,49.28 v33.91,50.16 | U2.7 58.05,9.29 57.4,8.64 55.63,8.64 v54.1,10.16 | v30.48,10.54 30.1,10.92 19.68,10.92 v19.3,10.54
SDA  (via drill 0.3)
  Top 0.305: 37.08,24.89 37.58,24.4 U4.1 37.58,22.09 36.83,21.34 35.81,21.34 35.05,20.57 v35.05,11.05 | U1.1 41.15,48.07 41.15,46.99 40.64,46.48 36.45,46.48 34.54,48.39 v34.54,49.53 | v34.54,50.8 v34.54,57.78 | U$5.2 6.59,14.97 v7.11,15.49 | U3.9 7.25,19.19 v6.86,18.8
  TopSignal 0.305: v34.54,57.78 34.04,58.29 2.54,58.29 1.4,57.15 1.42,17.91 | 1.42,17.91 1.4,6.48 2.67,5.21 18.16,5.21 19.3,6.35 19.3,9.65 18.41,10.54 v18.41,11.05 | v55.12,9.91 53.98,11.05 v35.05,11.05 v31.11,11.05 | v7.11,15.49 7.11,17.02 6.22,17.91 5.97,17.91 | 1.42,17.91 2.56,17.91 5.84,17.91 5.97,17.91 | v6.86,18.8 5.97,17.91
  Bottom 0.305: ZED1.C31 35.18,48.89 v34.54,49.53 v34.54,50.8 | U2.8 57.55,9.55 57.15,9.14 55.88,9.14 v55.12,9.91 | v31.11,11.05 30.73,11.43 18.8,11.43 v18.41,11.05
VOUTA  (1 unrouted)
  Bottom 0.406: U$1.B2 53.34,17.78 53.34,15.87 53.98,15.24 C24.1
VOUTB  (1 unrouted)
  Bottom 0.406: U$1.C2 50.8,17.78 50.8,15.87 50.16,15.24 C25.1